# EAGLE board SOM204-EVB_Rev_B (EAGLE 4.16), part 1 of 4
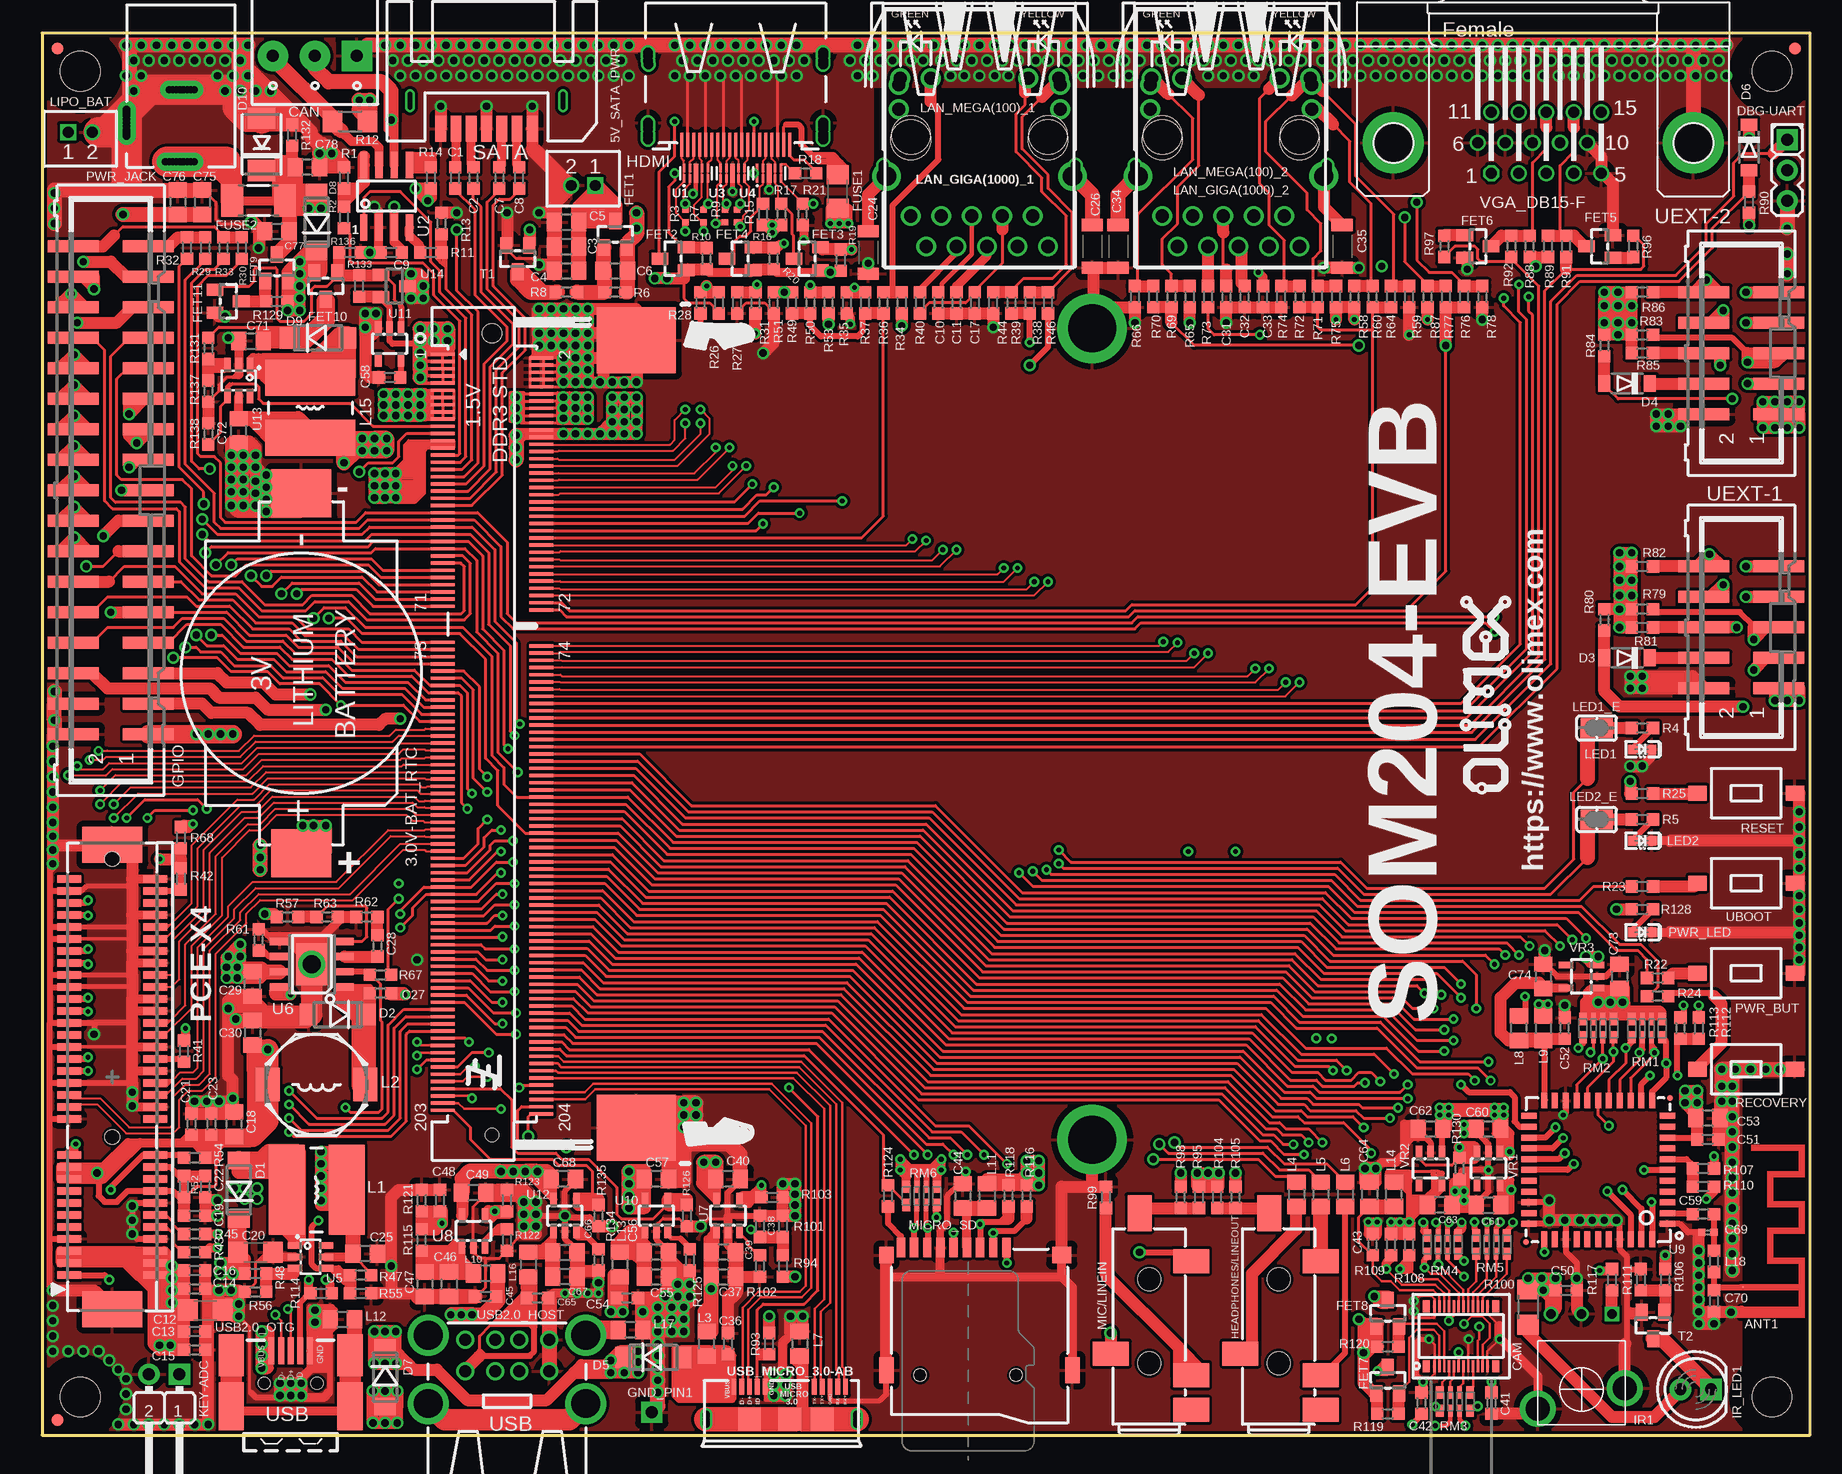
[diagram p5: board, top side]
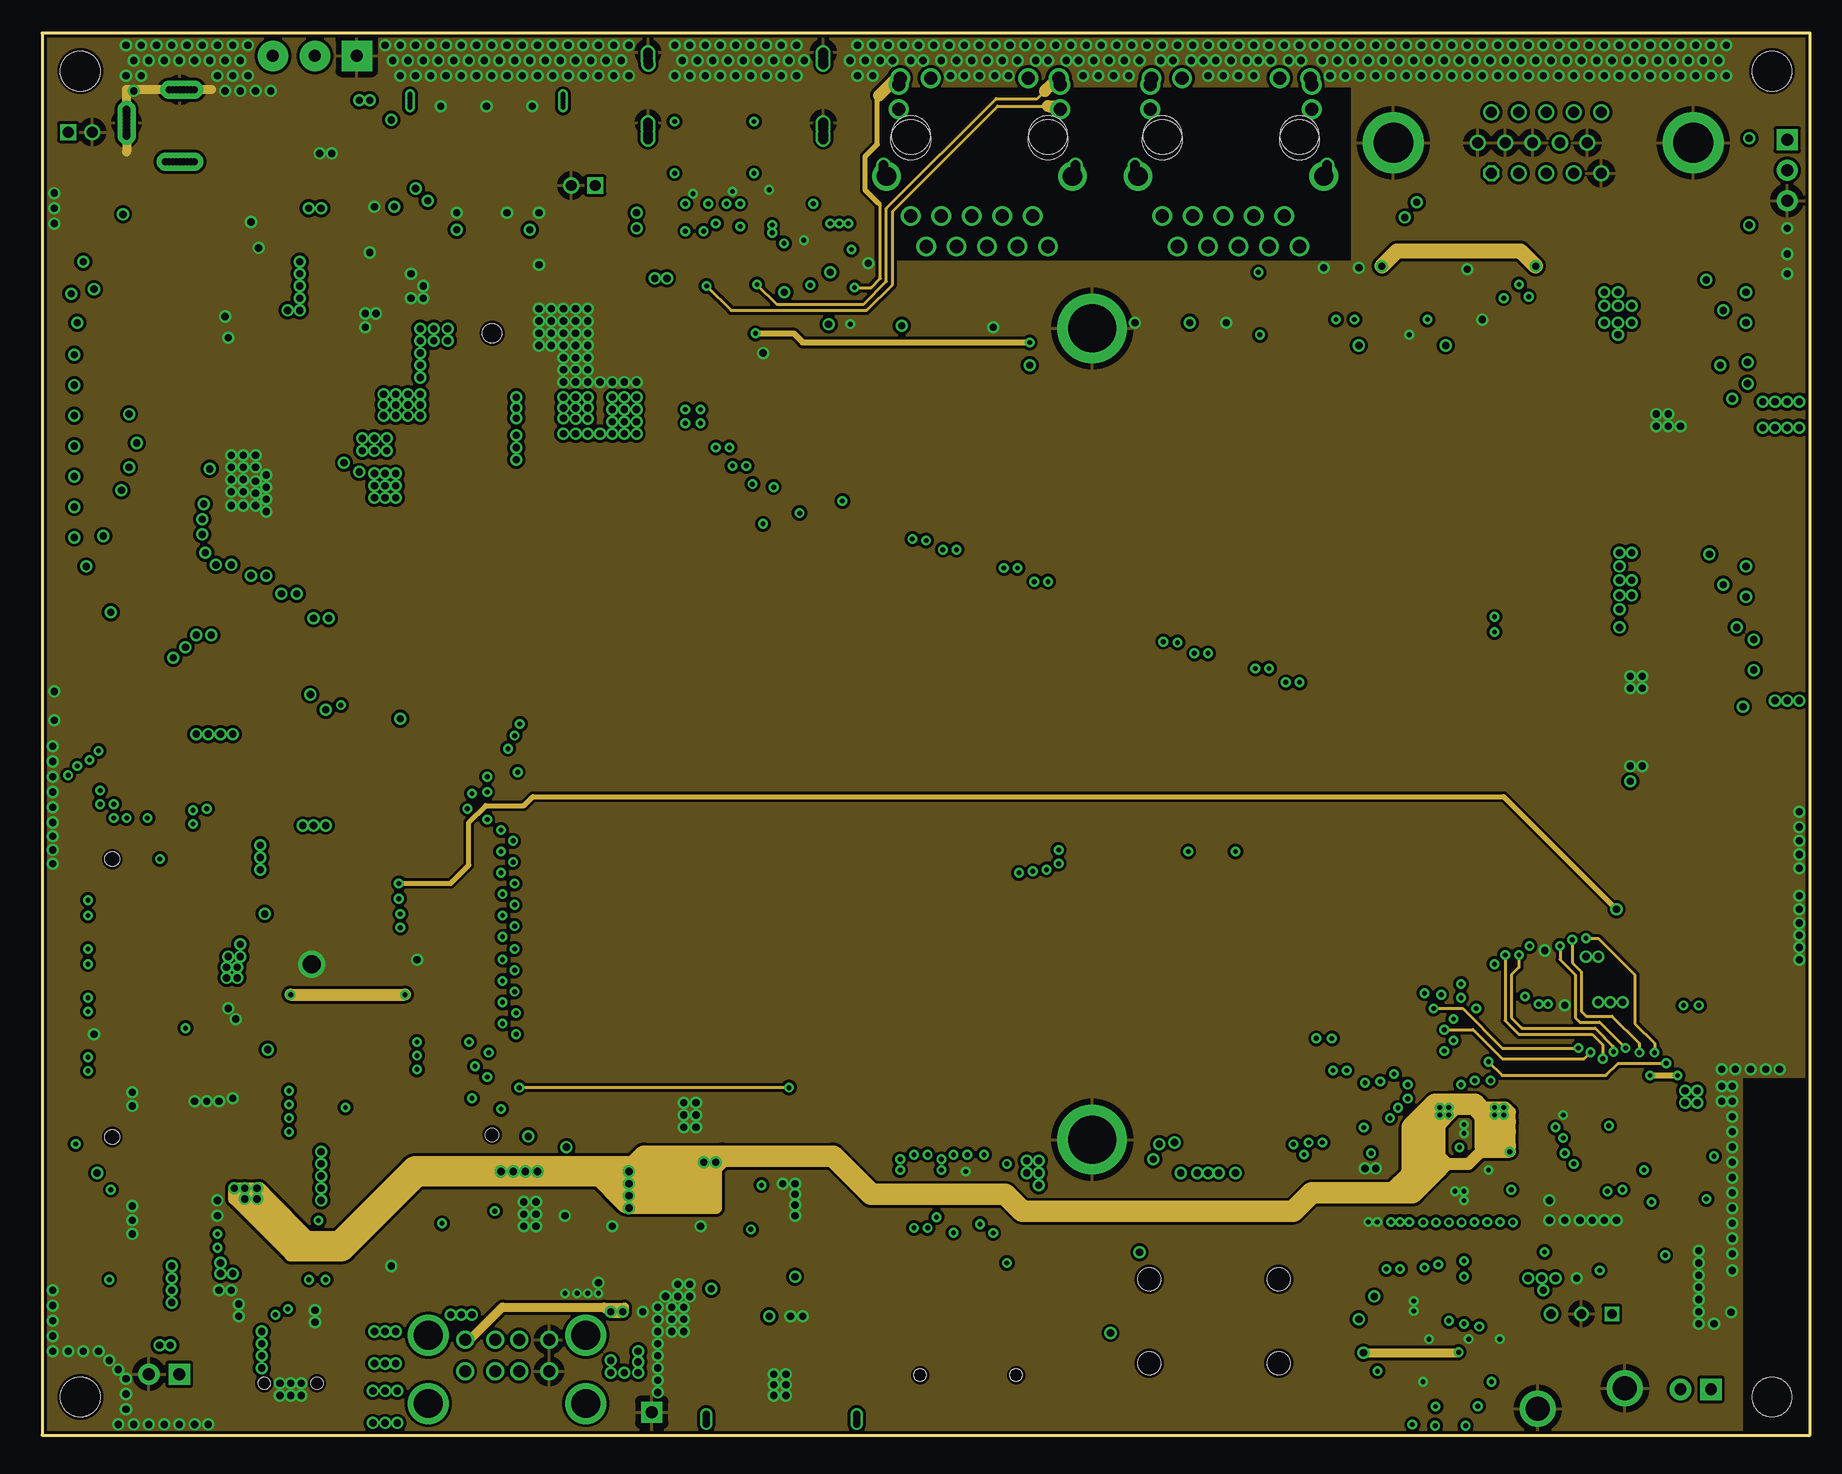
[diagram p6: board, inner layer Route2]
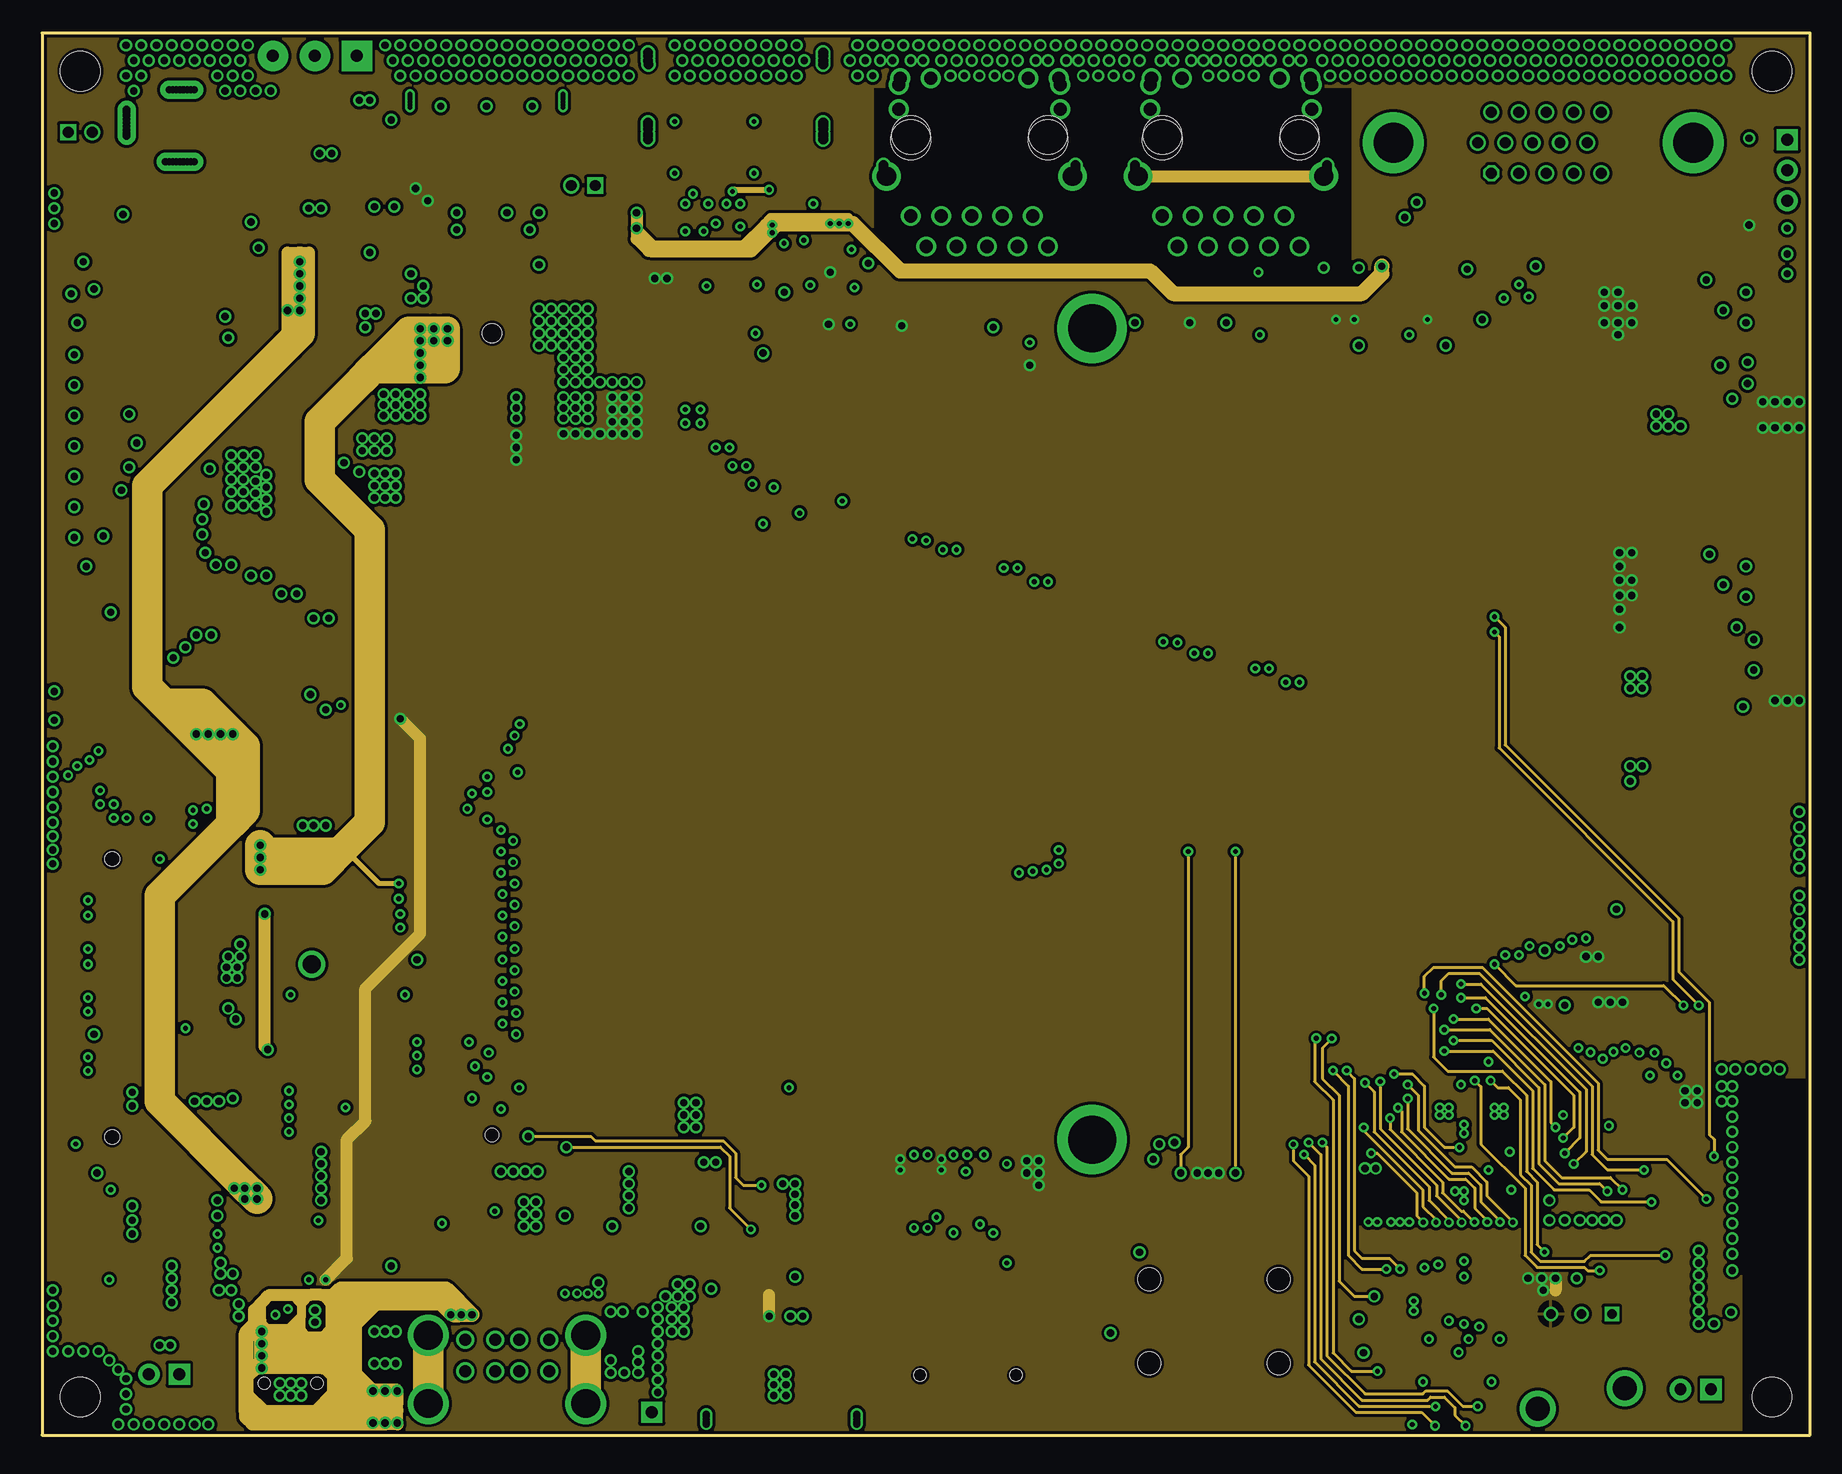
[diagram p7: board, inner layer Route15]
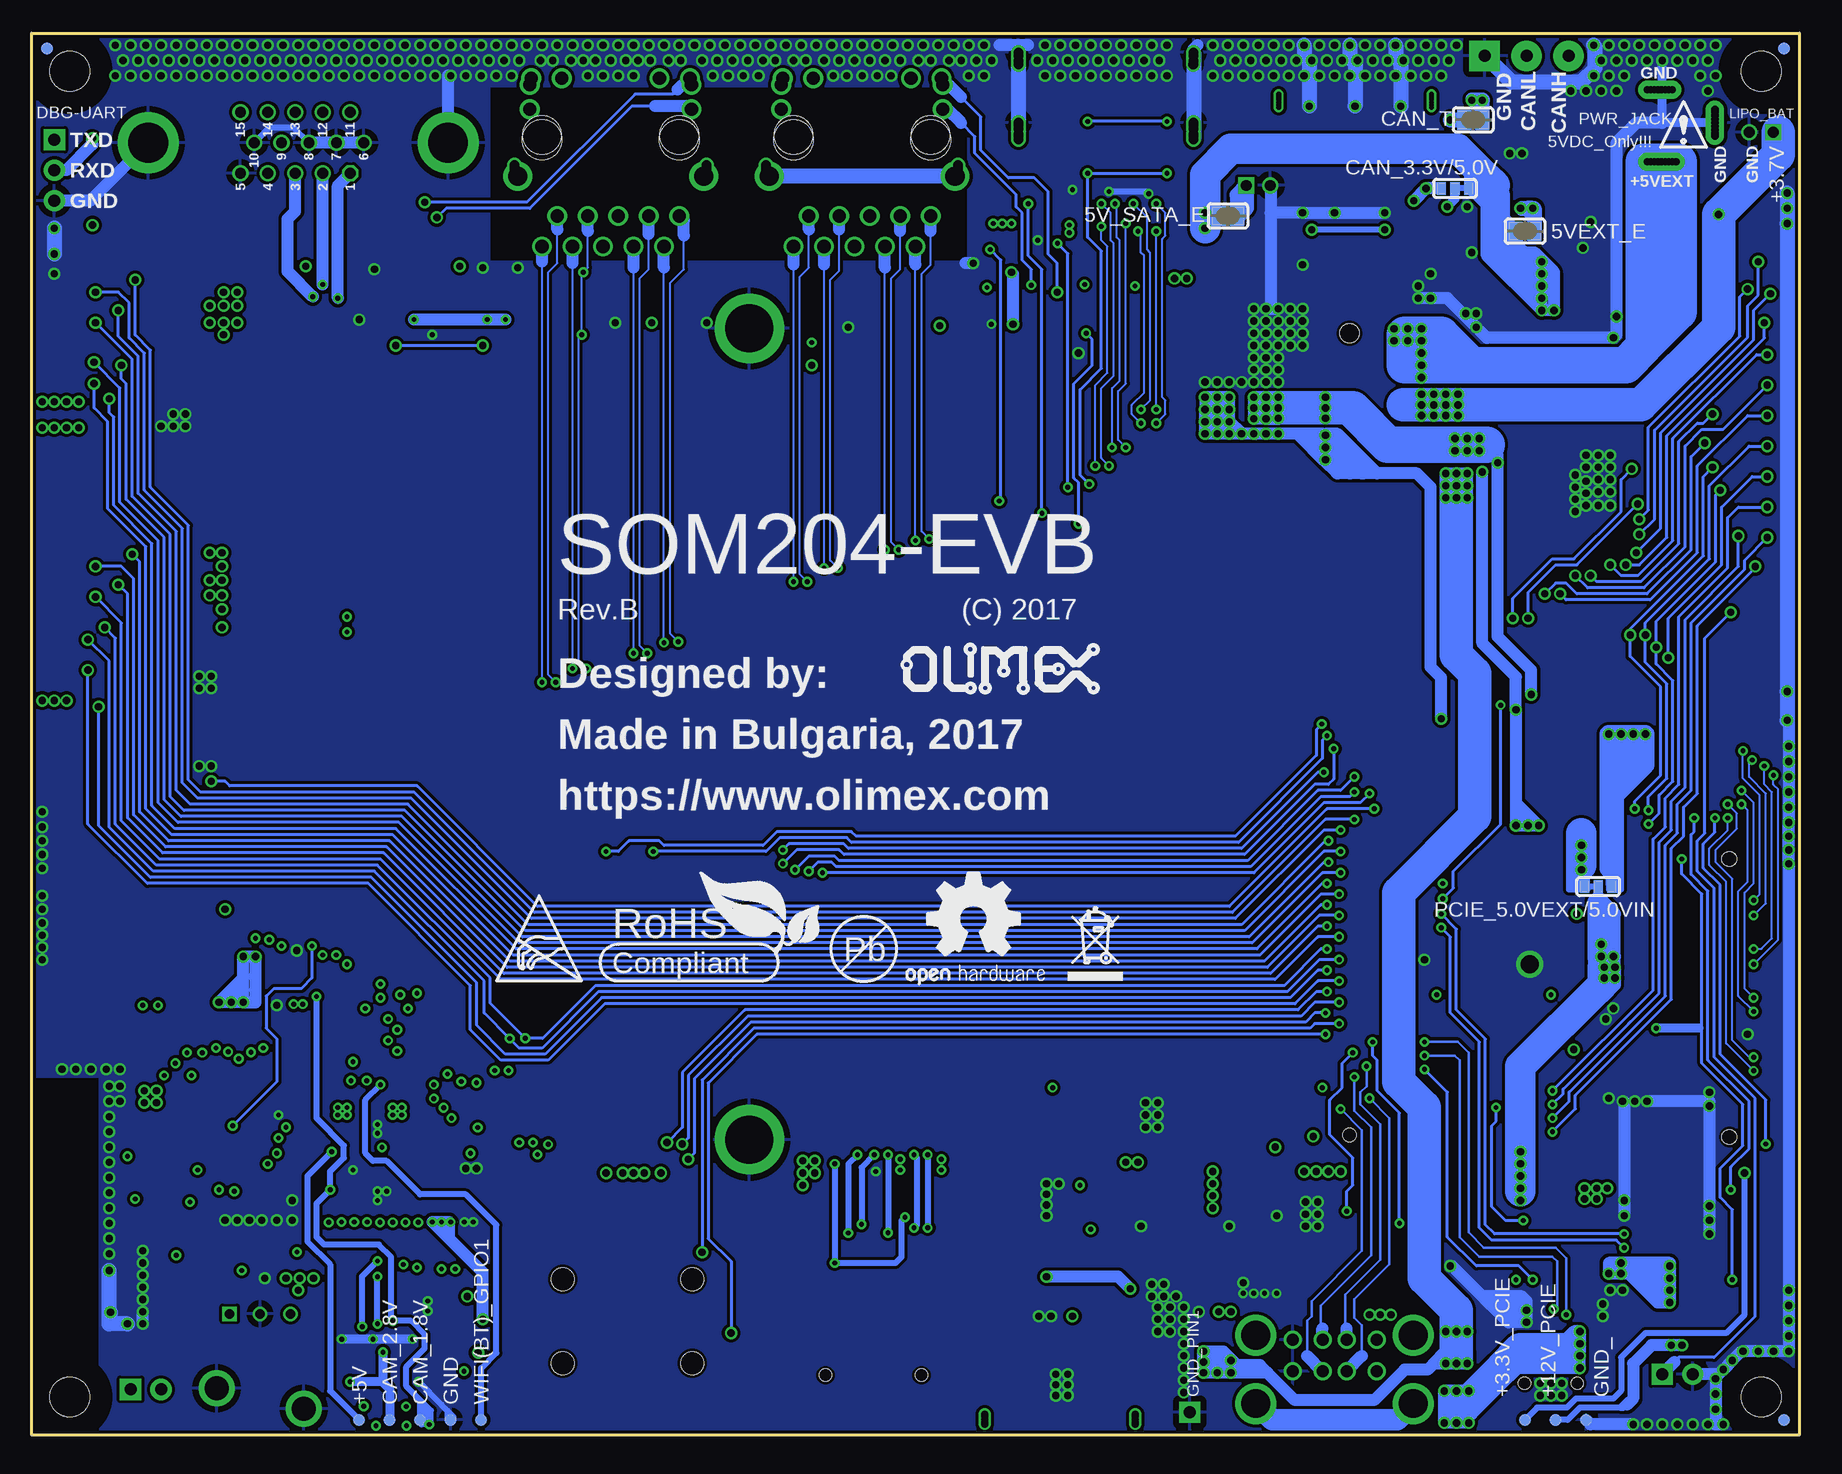
[diagram p8: board, bottom side, seen from below]

Size 147.32 x 116.84 mm. Coordinates in mm from the lower left corner, seen from the top.
Outline: 0,116.84 0,0 147.32,0 147.32,116.84 0,116.84
Copper layers (1*2+15*16): Top 0.035mm / dielectric 0.127mm / Route2 0.017mm / dielectric 1.1mm / Route15 0.017mm / dielectric 0.127mm / Bottom 0.035mm
Design rules "default": minimum track width 7mil, minimum drill 0.4mm, track to track 9.5mil, track to pad 9.5mil, pad to pad 9.5mil, via to via 9.5mil, smd to smd 1mil, copper to edge 0.2489mm, drill to drill 10mil, minimum pad ring 8mil, minimum via ring 8mil, stop-mask expansion 2mil, vias tented up to drill 40mil, thermal gap 20mil
Holes 3.3 mm at 3.17,3.17 144.15,3.17 144.15,113.67 3.17,113.67
tRestrict: area 0,0 to 6.3,6.3; area 141,0 to 147.3,6.3; area 141,110.5 to 147.3,116.8; area 0,110.5 to 6.3,116.8; 11 lines
bRestrict: area 0,0 to 6.3,6.3; area 141,0 to 147.3,6.3; area 141,110.5 to 147.3,116.8; area 0,110.5 to 6.3,116.8

## Footprints (pad centres in the part's own frame; a part is rotated, then mirrored left to right if it is on the bottom)
3V_BAT_HOLDER = smd 2 x 2: 1+ -15,0 | smd 4 x 5: + -15,0; - 15,0
SJ = smd 1.168 x 1.6: 1 -0.762,0; 2 0.762,0
DW02S = drill 0.9 square: 1 -1,0 | drill 0.9 round: 2 1,0
TESTPAD_40-ROUND = smd 1.016 x 1.016: 1 0,0
SMAL_SIZE-2.4GHZ_PCB_ANTENNA_MIRROR = smd 0.125 x 0.125: ANT -2.55,0.25 | drill 0.6 round: GND -0.45,-0.739
C0603_DWS = smd 1.016 x 1.016: 1 -0.889,0; 2 0.889,0
C0805_5MIL_DWS = smd 1.27 x 1.524: 1 -1.016,0; 2 1.016,0
C1206_5MIL_WS = smd 1.651 x 1.778: 1 -1.46,0; 2 1.46,0
C1206_5MILS_WS_ISO = smd 1.016 x 1.778: 1 -1.778,0; 2 1.778,0
C0402_TI = smd 0.61 x 0.584: 1 -0.508,0; 2 0.508,0
CAM_2M_GT2005 = smd 0.2 x 1: 1 -2.2,-2.5; 2 -2.2,2.5; 3 -1.8,-2.5; 4 -1.8,2.5; 5 -1.4,-2.5; 6 -1.4,2.5; 7 -1,-2.5; 8 -1,2.5; 9 -0.6,-2.5; 10 -0.6,2.5; 11 -0.2,-2.5; 12 -0.2,2.5; 13 0.2,-2.5; 14 0.2,2.5; 15 0.6,-2.5; 16 0.6,2.5; 17 1,-2.5; 18 1,2.5; 19 1.4,-2.5; 20 1.4,2.5; 21 1.8,-2.5; 22 1.8,2.5; 23 2.2,-2.5; 24 2.2,2.5 | smd 0.6 x 1: MP1 -2.9,-2.5; MP2 -2.9,2.5; MP3 2.9,-2.5; MP4 2.9,2.5
DG350-3.5_3P = drill 1 pad 2.54 square: 1 -3.5,0 | drill 1 pad 2.54 round: 2 0,0; 3 3.5,0
SJ_2_SMALL_12_TIED = smd 0.762 x 1.016: 1 -1.143,0; 2 0,0; 3 1.143,0
MLL-41 = smd 1.45 x 1.8: A 2.445,0; K -2.445,0
SOD-123 = smd 1 x 1.4: A 1.9,0; C -1.9,0
DO214AA = smd 1.778 x 2.286: A 2.177,0; C -2.177,0
HN1X3 = drill 1 pad 1.778 square: 1 -2.54,0 | drill 1 pad 1.778 round: 2 0,0; 3 2.54,0
SOT23 = smd 1.4 x 1: 1 1.1,-0.95; 2 1.1,0.95; 3 -1.1,0
FIDUCIAL-1X3 = smd 1 x 1: 1 0,0
1206 = smd 1.6 x 1.8: 1 -1.4,0; 2 1.4,0
R5025 = smd 1.8 x 2.7: 1 -2.2,0; 2 2.2,0
TEST_PAD40/70/SQUARE = drill 1.016 pad 1.778 square: P$1 0,0
ML34-MALE(GBH-254-SMT-34)_TEST = smd 1 x 4.25: 1 -20.32,-3.125; 2 -20.32,3.125; 3 -17.78,-3.125; 4 -17.78,3.125; 5 -15.24,-3.125; 6 -15.24,3.125; 7 -12.7,-3.125; 8 -12.7,3.125; 9 -10.16,-3.125; 10 -10.16,3.125; 11 -7.62,-3.125; 12 -7.62,3.125; 13 -5.08,-3.125; 14 -5.08,3.125; 15 -2.54,-3.125; 16 -2.54,3.125; 17 0,-3.125; 18 0,3.125; 19 2.54,-3.125; 20 2.54,3.125; 21 5.08,-3.125; 22 5.08,3.125; 23 7.62,-3.125; 24 7.62,3.125; 25 10.16,-3.125; 26 10.16,3.125; 27 12.7,-3.125; 28 12.7,3.125; 29 15.24,-3.125; 30 15.24,3.125; 31 17.78,-3.125; 32 17.78,3.125; 33 20.32,-3.125; 34 20.32,3.125
HDMI-SWM-19_TEST = smd 0.25 x 2: 1 -4.5,-5.75; 2 -4,-5.75; 3 -3.5,-5.75; 4 -3,-5.75; 5 -2.5,-5.75; 6 -2,-5.75; 7 -1.5,-5.75; 8 -1,-5.75; 9 -0.5,-5.75; 10 0,-5.75; 11 0.5,-5.75; 12 1,-5.75; 13 1.5,-5.75; 14 2,-5.75; 15 2.5,-5.75; 16 3,-5.75; 17 3.5,-5.75; 18 4,-5.75; 19 4.5,-5.75 | drill 0.8 round: P$5 -7.3,-4.85; P$7 -7.3,1.25; P$9 7.3,1.25; P$11 7.3,-4.85; P$13 -7.3,-4.45; P$15 -7.3,1.65; P$18 7.3,1.65; P$20 7.3,-4.45; P$21 -7.3,-4.15; P$22 -7.3,-5; P$23 7.3,-5; P$24 7.3,-4.15; P$25 -7.3,-5.3; P$26 7.3,-5.3; P$27 7.3,0.95; P$28 -7.275,0.95; SH1 -7.3,-3.9; SH2 -7.3,1.95; SH3 7.3,1.95; SH4 7.3,-3.9
PJ-W47S-05D2-LF_5PIN_V2 = smd 2 x 3: 1 2.1,-0.5; 2 14.5,-0.5; 3 6.8,6.2; 5 5,-0.5 | smd 3 x 2: 4 18.5,3.8 | hole 1.9: 6,3; 13,3
RPM7236 = drill 0.8 square: 1 -2.54,-6.3 | drill 0.8 round: 2 0,-6.3; 3 2.54,-6.3 | drill 2 round: P$4 -3.63,-0.1; P$5 3.63,1.6
LED-5.0MM = drill 0.991 pad 1.778 round: A -1.27,0 | drill 0.991 pad 1.778 square: K 1.27,0
JP1R = drill 1 pad 1.778 square: 1 -1.27,0 | drill 1 pad 1.778 round: 2 1.27,0
CD73(75) = smd 3 x 7.5: 1 -2.5,0; 2 2.5,0
CDRH8D43 = smd 2 x 2.8: 1 -4.05,0; 2 4.05,0
L0805_5MIL_DWS = smd 1.27 x 1.524: 1 -1.016,0; 2 1.016,0
L0603_5MIL_DWS = smd 1.016 x 1.016: 1 -0.889,0; 2 0.889,0
TM211Q01FM22_SH = drill 1.1 round: 1 -5.715,-6.35; 2 -4.445,-8.89; 3 -3.175,-6.35; 4 -1.905,-8.89; 5 -0.635,-6.35; 6 0.635,-8.89; 7 1.905,-6.35; 8 3.175,-8.89; 9 4.445,-6.35; 10 5.715,-8.89; 11 -6.731,2.54; 12 -6.731,4.572; 13 6.731,2.54; 14 6.731,4.572 | drill 1.6 round: SH1 -7.747,-3.048; SH2 7.747,-3.048 | hole 3.3: 5.715,0; -5.715,0
RJLBC-060TC1_MILLING = drill 0.9 round: 1 -4.455,6.7; 2 -3.185,9.24; 3 -1.915,6.7; 4 -0.645,9.24; 5 0.625,6.7; 6 1.895,9.24; 7 3.165,6.7; 8 4.435,9.24 | drill 0.8 round: _1 -8,2.5; _2 -8,2.7; _3 -8,2.9; _4 -8,3.3; _5 -8,3.5; _6 8,3.5; _7 8,3.3; _8 8,2.9; _9 8,2.7; _10 8,2.5; GND1 -8,3.1; GND2 8,3.1 | drill 1.1 round: AG 4.07,-4.748; AY -6.61,-4.748; KG 6.61,-4.748; KY -4.07,-4.748 | hole 3.2: -5.715,0; 5.715,0
LED-0603_TEST = smd 0.8 x 0.8: A 0.762,0; C -0.762,0
SJ-CLOSE = smd 1.168 x 1.6: 1 -0.762,0; 2 0.762,0
TFC-WPAPR-08_BIGGER_CREAM = smd 1.6 x 0.7: 1 -6.994,2.25; 2 -6.994,1.15; 3 -6.994,0.05; 4 -6.994,-1.05; 5 -6.994,-2.15; 6 -6.994,-3.25; 7 -6.994,-4.35; 8 -6.994,-5.45; 9 -6.994,-6.55 | smd 1.4 x 1.2: 10 -6.369,-7.75 | smd 1.4 x 1.6: 11 -6.369,6.85 | smd 2.2 x 1.2: 12 3.231,-7.75; 13 3.231,7.75 | hole 1: 3.631,-4.95; 3.631,3.05
PCIX-VPC-064-LF = smd 0.6 x 2: 1 16.5,-3.6; 2 16.5,3.6; 3 15.5,-3.6; 4 15.5,3.6; 5 14.5,-3.6; 6 14.5,3.6; 7 13.5,-3.6; 8 13.5,3.6; 9 12.5,-3.6; 10 12.5,3.6; 11 11.5,-3.6; 12 11.5,3.6; 13 10.5,-3.6; 14 10.5,3.6; 15 9.5,-3.6; 16 9.5,3.6; 17 8.5,-3.6; 18 8.5,3.6; 19 7.5,-3.6; 20 7.5,3.6; 21 6.5,-3.6; 22 6.5,3.6; 23 3.5,-3.6; 24 3.5,3.6; 25 2.5,-3.6; 26 2.5,3.6; 27 1.5,-3.6; 28 1.5,3.6; 29 0.5,-3.6; 30 0.5,3.6; 31 -0.5,-3.6; 32 -0.5,3.6; 33 -1.5,-3.6; 34 -1.5,3.6; 35 -2.5,-3.6; 36 -2.5,3.6; 37 -3.5,-3.6; 38 -3.5,3.6; 39 -4.5,-3.6; 40 -4.5,3.6; 41 -5.5,-3.6; 42 -5.5,3.6; 43 -6.5,-3.6; 44 -6.5,3.6; 45 -7.5,-3.6; 46 -7.5,3.6; 47 -8.5,-3.6; 48 -8.5,3.6; 49 -9.5,-3.6; 50 -9.5,3.6; 51 -10.5,-3.6; 52 -10.5,3.6; 53 -11.5,-3.6; 54 -11.5,3.6; 55 -12.5,-3.6; 56 -12.5,3.6; 57 -13.5,-3.6; 58 -13.5,3.6; 59 -14.5,-3.6; 60 -14.5,3.6; 61 -15.5,-3.6; 62 -15.5,3.6; 63 -16.5,-3.6; 64 -16.5,3.6 | smd 3 x 5: MP1 19.35,0; MP2 -19.35,0 | hole 1.2: 5,0; -18.15,0
WS-TAKT_6X3.5_SMD_NOCREAM = smd 1.27 x 1.524: P$1 0,4.064; P$2 0,-4.064
PWR_JACK_UNI_MILLING_SMALLER_DRILLS = drill 0.6 pad 1.5 round: + -0.196,4.75; +1 -0.196,5.05; +2 -0.196,5.35; +3 -0.196,5.65; +4 -0.196,4.45; +5 -0.196,4.15; +6 -0.196,3.85; +7 -0.196,3.55; +8 -0.196,5.95; - -6.196,4.75; -1 -6.196,5.05; -2 -6.196,5.35; -3 -6.196,4.45; -4 -6.196,4.15; -5 -6.196,5.65; -6 -6.196,3.85; -8 -6.196,5.95; -- -3.446,0.3; --1 -3.746,0.3; --2 -4.046,0.3; --3 -4.346,0.3; --4 -3.146,0.3; --5 -2.846,0.3; --6 -2.546,0.3; --14 -4.546,0.3; --15 -2.346,0.3
R0603_5MIL_DWS = smd 1.016 x 1.016: 1 -0.889,0; 2 0.889,0
R0402_SMALL = smd 0.5 x 0.55: 1 -0.508,0; 2 0.508,0
R1206_5MIL_WS = smd 1.651 x 1.778: 1 -1.46,0; 2 1.46,0
0603_0R = smd 1.016 x 1.016: 1 -0.889,0; 2 0.889,0
R1206_5MIL = smd 1.651 x 1.778: 1 -1.46,0; 2 1.46,0
R_MATRIX_4 = smd 0.635 x 1.016: 1.1 -1.27,-0.762; 1.2 -1.27,0.762; 4.1 1.27,-0.762; 4.2 1.27,0.762 | smd 0.381 x 1.016: 2.1 -0.381,-0.762; 2.2 -0.381,0.762; 3.1 0.381,-0.762; 3.2 0.381,0.762
SATA-PWA-07-TEST = smd 0.9 x 2.2: 1 -4.25,-4.8; 2 -2.98,-4.8; 3 -1.71,-4.8; 4 -0.44,-4.8; 5 0.83,-4.8; 6 2.1,-4.8; 7 3.37,-4.8 | drill 0.4 round: P$1 -6.81,-2.35; P$2 -6.81,-2.125; P$3 -6.81,-2.6; P$4 -6.81,-1.925; P$5 -6.81,-3.025; P$11 5.93,-2.35; P$20 5.93,-2.125; P$23 5.93,-2.6; P$24 5.93,-1.925; P$26 5.93,-3.025; SH1 -6.81,-2.825; SH4 5.93,-2.825
DDR204(2-2013289-1) = smd 0.27 x 2: 1 -31.65,-4.1; 2 -31.35,4.1; 3 -31.05,-4.1; 4 -30.75,4.1; 5 -30.45,-4.1; 6 -30.15,4.1; 7 -29.85,-4.1; 8 -29.55,4.1; 9 -29.25,-4.1; 10 -28.95,4.1; 11 -28.65,-4.1; 12 -28.35,4.1; 13 -28.05,-4.1; 14 -27.75,4.1; 15 -27.45,-4.1; 16 -27.15,4.1; 17 -26.85,-4.1; 18 -26.55,4.1; 19 -26.25,-4.1; 20 -25.95,4.1; 21 -25.65,-4.1; 22 -25.35,4.1; 23 -25.05,-4.1; 24 -24.75,4.1; 25 -24.45,-4.1; 26 -24.15,4.1; 27 -23.85,-4.1; 28 -23.55,4.1; 29 -23.25,-4.1; 30 -22.95,4.1; 31 -22.65,-4.1; 32 -22.35,4.1; 33 -22.05,-4.1; 34 -21.75,4.1; 35 -21.45,-4.1; 36 -21.15,4.1; 37 -20.85,-4.1; 38 -20.55,4.1; 39 -20.25,-4.1; 40 -19.95,4.1; 41 -19.65,-4.1; 42 -19.35,4.1; 43 -19.05,-4.1; 44 -18.75,4.1; 45 -18.45,-4.1; 46 -18.15,4.1; 47 -17.85,-4.1; 48 -17.55,4.1; 49 -17.25,-4.1; 50 -16.95,4.1; 51 -16.65,-4.1; 52 -16.35,4.1; 53 -16.05,-4.1; 54 -15.75,4.1; 55 -15.45,-4.1; 56 -15.15,4.1; 57 -14.85,-4.1; 58 -14.55,4.1; 59 -14.25,-4.1; 60 -13.95,4.1; 61 -13.65,-4.1; 62 -13.35,4.1; 63 -13.05,-4.1; 64 -12.75,4.1; 65 -12.45,-4.1; 66 -12.15,4.1; 67 -11.85,-4.1; 68 -11.55,4.1; 69 -11.25,-4.1; 70 -10.95,4.1; 71 -10.65,-4.1; 72 -10.35,4.1; 73 -7.65,-4.1; 74 -7.35,4.1; 75 -7.05,-4.1; 76 -6.75,4.1; 77 -6.45,-4.1; 78 -6.15,4.1; 79 -5.85,-4.1; 80 -5.55,4.1; 81 -5.25,-4.1; 82 -4.95,4.1; 83 -4.65,-4.1; 84 -4.35,4.1; 85 -4.05,-4.1; 86 -3.75,4.1; 87 -3.45,-4.1; 88 -3.15,4.1; 89 -2.85,-4.1; 90 -2.55,4.1; 91 -2.25,-4.1; 92 -1.95,4.1; 93 -1.65,-4.1; 94 -1.35,4.1; 95 -1.05,-4.1; 96 -0.75,4.1; 97 -0.45,-4.1; 98 -0.15,4.1; 99 0.15,-4.1; 100 0.45,4.1; 101 0.75,-4.1; 102 1.05,4.1; 103 1.35,-4.1; 104 1.65,4.1; 105 1.95,-4.1; 106 2.25,4.1; 107 2.55,-4.1; 108 2.85,4.1; 109 3.15,-4.1; 110 3.45,4.1; 111 3.75,-4.1; 112 4.05,4.1; 113 4.35,-4.1; 114 4.65,4.1; 115 4.95,-4.1; 116 5.25,4.1; 117 5.55,-4.1; 118 5.85,4.1; 119 6.15,-4.1; 120 6.45,4.1; 121 6.75,-4.1; 122 7.05,4.1; 123 7.35,-4.1; 124 7.65,4.1; 125 7.95,-4.1; 126 8.25,4.1; 127 8.55,-4.1; 128 8.85,4.1; 129 9.15,-4.1; 130 9.45,4.1; 131 9.75,-4.1; 132 10.05,4.1; 133 10.35,-4.1; 134 10.65,4.1; 135 10.95,-4.1; 136 11.25,4.1; 137 11.55,-4.1; 138 11.85,4.1; 139 12.15,-4.1; 140 12.45,4.1; 141 12.75,-4.1; 142 13.05,4.1; 143 13.35,-4.1; 144 13.65,4.1; 145 13.95,-4.1; 146 14.25,4.1; 147 14.55,-4.1; 148 14.85,4.1; 149 15.15,-4.1; 150 15.45,4.1; 151 15.75,-4.1; 152 16.05,4.1; 153 16.35,-4.1; 154 16.65,4.1; 155 16.95,-4.1; 156 17.25,4.1; 157 17.55,-4.1; 158 17.85,4.1; 159 18.15,-4.1; 160 18.45,4.1; 161 18.75,-4.1; 162 19.05,4.1; 163 19.35,-4.1; 164 19.65,4.1; 165 19.95,-4.1; 166 20.25,4.1; 167 20.55,-4.1; 168 20.85,4.1; 169 21.15,-4.1; 170 21.45,4.1; 171 21.75,-4.1; 172 22.05,4.1; 173 22.35,-4.1; 174 22.65,4.1; 175 22.95,-4.1; 176 23.25,4.1; 177 23.55,-4.1; 178 23.85,4.1; 179 24.15,-4.1; 180 24.45,4.1; 181 24.75,-4.1; 182 25.05,4.1; 183 25.35,-4.1; 184 25.65,4.1; 185 25.95,-4.1; 186 26.25,4.1; 187 26.55,-4.1; 188 26.85,4.1; 189 27.15,-4.1; 190 27.45,4.1; 191 27.75,-4.1; 192 28.05,4.1; 193 28.35,-4.1; 194 28.65,4.1; 195 28.95,-4.1; 196 29.25,4.1; 197 29.55,-4.1; 198 29.85,4.1; 199 30.15,-4.1; 200 30.45,4.1; 201 30.75,-4.1; 202 31.05,4.1; 203 31.35,-4.1; 204 31.65,4.1 | drill 4 pad 5.8 round: MH1 -33.8,50; MH2 33.8,50 | smd 5.5 x 6.6: MP1 -32.8,12; MP2 32.8,12 | hole 1.6: -33.4,0 | hole 1.1: 33.4,0
SOT-23 = smd 1.4 x 1: 1 1.1,-0.95; 2 1.1,0.95; 3 -1.1,0
SLP2510P8 = smd 0.2 x 0.675: 1 -1,-0.438; 2 -0.5,-0.438; 4 0.5,-0.438; 5 1,-0.438; 6 1,0.438; 7 0.5,0.438; 9 -0.5,0.438; 10 -1,0.438 | smd 0.4 x 0.775: 3 0,-0.388; 8 0,0.388
SO-08 = smd 0.6 x 2.2: 1 -1.905,-2.6; 2 -0.635,-2.6; 3 0.635,-2.6; 4 1.905,-2.6; 5 1.905,2.6; 6 0.635,2.6; 7 -0.635,2.6; 8 -1.905,2.6
SOT23-6 = smd 1.2 x 0.55: 1 1.3,-0.95; 2 1.3,0; 3 1.3,0.95; 4 -1.3,0.95; 5 -1.3,0; 6 -1.3,-0.95
SOIC8E = smd 0.61 x 1.6: 1 -1.905,-2.7; 2 -0.635,-2.7; 3 0.635,-2.7; 4 1.905,-2.7; 5 1.905,2.7; 6 0.635,2.7; 7 -0.635,2.7; 8 -1.905,2.7 | smd 3.51 x 2.62: EP 0,0 | drill 1.5 round: EP1 0,0
SOT23-5 = smd 1.2 x 0.55: 1 1.3,-0.95; 2 1.3,0; 3 1.3,0.95; 4 -1.3,0.95; 5 -1.3,-0.95
RL-SM02BD(RTL8723BS) = smd 1.3 x 0.5: 1 -5.775,4.5; 2 -5.775,3.6; 3 -5.775,2.7; 4 -5.775,1.8; 5 -5.775,0.9; 6 -5.775,0; 7 -5.775,-0.9; 8 -5.775,-1.8; 9 -5.775,-2.7; 10 -5.775,-3.6; 11 -5.775,-4.5; 23 5.775,-4.5; 24 5.775,-3.6; 25 5.775,-2.7; 26 5.775,-1.8; 27 5.775,-0.9; 28 5.775,0; 29 5.775,0.9; 30 5.775,1.8; 31 5.775,2.7; 32 5.775,3.6; 33 5.775,4.5 | smd 0.5 x 1.3: 12 -4.5,-5.775; 13 -3.6,-5.775; 14 -2.7,-5.775; 15 -1.8,-5.775; 16 -0.9,-5.775; 17 0,-5.775; 18 0.9,-5.775; 19 1.8,-5.775; 20 2.7,-5.775; 21 3.6,-5.775; 22 4.5,-5.775; 34 4.5,5.775; 35 3.6,5.775; 36 2.7,5.775; 37 1.8,5.775; 38 0.9,5.775; 39 0,5.775; 40 -0.9,5.775; 41 -1.8,5.775; 42 -2.7,5.775; 43 -3.6,5.775; 44 -4.5,5.775 | smd 0.5 x 0.5: FID1 -6,-6; FID2 6,6
ML10-MALE(GBH-254-SMT-10)_TEST = smd 1 x 4.25: 1 -5.08,-3.125; 2 -5.08,3.125; 3 -2.54,-3.125; 4 -2.54,3.125; 5 0,-3.125; 6 0,3.125; 7 2.54,-3.125; 8 2.54,3.125; 9 5.08,-3.125; 10 5.08,3.125
USB_TWO_LEVEL = drill 1 round: 1.1 -3.5,2.62; 1.2 -1,2.62; 1.3 1,2.62; 1.4 3.5,2.62; 2.1 -3.5,0; 2.2 -1,0; 2.3 1,0; 2.4 3.5,0 | drill 2.4 round: GND1 -6.57,-2.7; GND2 6.57,-2.7; GND3 6.57,3; GND4 -6.57,3
USB_MINI_9PIN = smd 2.25 x 0.5: D+ -3.722,0; D- -3.722,-0.8; GND -3.722,1.6; ID -3.722,0.8; VBUS -3.722,-1.6 | smd 4 x 2.1: GND1 0.884,-4.95; GND3 0.884,4.95 | smd 3.5 x 2.1: GND2 -3.366,-4.95; GND4 -3.366,4.95 | hole 1: -1.016,-2.2; -1.016,2.2
USB_MICRO_3.0 = smd 0.4 x 1.35: 1 -3.95,2; 2 -3.3,2; 3 -2.65,2; 4 -2,2; 5 -1.35,2; 6 2.75,2; 7 3.4,2; 8 4.05,2; 9 4.7,2; 10 5.35,2 | drill 0.6 round: P$1 -6.26,-0.45; P$2 -6.26,-0.95; P$3 6.29,-0.45; P$4 6.29,-0.95; P$5 -6.26,-0.3; P$6 -6.26,-1.1; P$7 6.29,-0.3; P$8 6.29,-1.1; SH1 -6.26,-0.7; SH2 6.29,-0.7 | smd 1.9 x 1.9: SH3 -2.65,-0.7; SH6 3.4,-0.7 | smd 0.95 x 1.9: SH4 0.225,-0.7; SH5 1.175,-0.7
DB15-F_22MM = drill 0.9 octagon: 1 4.329,6.35 | drill 0.9 round: 2 2.043,6.35; 3 -0.243,6.35; 4 -2.529,6.35; 5 -4.815,6.35; 6 5.472,3.81; 7 3.186,3.81; 8 0.9,3.81; 9 -1.386,3.81; 10 -3.672,3.81; 11 4.329,1.27; 12 2.043,1.27; 13 -0.243,1.27; 14 -2.529,1.27; 15 -4.815,1.27 | drill 3.302 pad 5.08 round: GND1 -12.497,3.81; GND2 12.497,3.81
SOT-23-5 = smd 1.2 x 0.55: 1 1.3,-0.95; 2 1.3,0; 3 1.3,0.95; 4 -1.3,0.95; 5 -1.3,-0.95

## Placement (x,y rotation side)
3.0V-BAT_RTC  BTH-V-20-LF  [3V_BAT_HOLDER]  21.59,63.5 90 top
5V_SATA_E  Opened  [SJ]  47.62,101.6 180 bottom
5V_SATA_PWR  DW02S  [DW02S]  45.09,104.14 180 top
5VEXT_E  Opened  [SJ]  22.86,100.33 180 bottom
+3.3V_PCIE  TESTPADTESTPAD_40-ROUND  [TESTPAD_40-ROUND]  22.86,1.27 270 bottom
+5V  TESTPADTESTPAD_40-ROUND  [TESTPAD_40-ROUND]  120.02,1.27 180 bottom
+12V_PCIE  TESTPADTESTPAD_40-ROUND  [TESTPAD_40-ROUND]  20.32,1.27 270 bottom
ANT1  PCB-ANTENNA  [SMAL_SIZE-2.4GHZ_PCB_ANTENNA_MIRROR]  141.48,9.78 270 top
C1  10nF/50V/10%/X7R/C0603  [C0603_DWS]  34.42,104.78 90 top
C2  10nF/50V/10%/X7R/C0603  [C0603_DWS]  35.94,104.78 90 top
C3  47uF/6.3V/20%/X5R/C0805  [C0805_5MIL_DWS]  43.69,99.06 0 top
C4  47uF/6.3V/20%/X5R/C0805  [C0805_5MIL_DWS]  43.69,97.03 0 top
C5  47uF/6.3V/20%/X5R/C0805  [C0805_5MIL_DWS]  43.69,101.09 0 top
C6  47uF/6.3V/20%/X5R/C0805  [C0805_5MIL_DWS]  47.75,97.03 0 top
C7  10nF/50V/10%/X7R/C0603  [C0603_DWS]  38.1,104.78 90 top
C8  10nF/50V/10%/X7R/C0603  [C0603_DWS]  39.75,104.78 90 top
C9  100nF/50V/20%/Y5V/C0603  [C0603_DWS]  29.08,98.55 180 top
C10  NA(100nF/50V/20%/Y5V/C0603)  [C0603_DWS]  74.68,94.36 90 top
C11  NA(100nF/50V/20%/Y5V/C0603)  [C0603_DWS]  76.2,94.36 90 top
C12  22uF/25V/X7R/C1206  [C1206_5MIL_WS]  13.59,10.41 0 top
C13  100nF/50V/20%/Y5V/C0603  [C0603_DWS]  12.7,8.64 0 top
C14  100nF/50V/20%/Y5V/C0603  [C0603_DWS]  12.7,12.19 0 top
C15  100nF/50V/20%/Y5V/C0603  [C0603_DWS]  12.7,7.11 0 top
C16  100nF/50V/20%/Y5V/C0603  [C0603_DWS]  12.7,13.72 0 top
C17  100nF/50V/20%/Y5V/C0603  [C0603_DWS]  77.72,94.36 90 top
C18  47uF/6.3V/20%/X5R/C0805  [C0805_5MIL_DWS]  16,25.91 90 top
C19  100nF/50V/20%/Y5V/C0603  [C0603_DWS]  12.7,18.29 0 top
C20  22uF/25V/X7R/C1206  [C1206_5MIL_WS]  17.78,15.24 0 top
C21  100nF/50V/20%/Y5V/C0603  [C0603_DWS]  12.45,25.91 90 top
C22  100nF/50V/20%/Y5V/C0603  [C0603_DWS]  13.59,20.7 270 top
C23  100nF/50V/20%/Y5V/C0603  [C0603_DWS]  14.1,25.91 90 top
C24  1nF/2kV/X7R/C1206  [C1206_5MILS_WS_ISO]  68.83,98.55 270 top
C25  47uF/6.3V/20%/X5R/C0805  [C0805_5MIL_DWS]  26.92,15.11 180 top
C26  NA(1nF/2kV/X7R/C1206)  [C1206_5MILS_WS_ISO]  87.5,99.06 270 top
C27  100nF/50V/20%/Y5V/C0603  [C0603_DWS]  28.19,36.83 180 top
C28  220pF/50V/5%/COG/C0603  [C0603_DWS]  27.94,40.77 90 top
C29  47uF/6.3V/20%/X5R/C0805  [C0805_5MIL_DWS]  17.53,37.59 90 top
C30  47uF/6.3V/20%/X5R/C0805  [C0805_5MIL_DWS]  17.53,33.53 270 top
C31  100nF/50V/20%/Y5V/C0603  [C0603_DWS]  98.68,94.87 90 top
C32  100nF/50V/20%/Y5V/C0603  [C0603_DWS]  100.2,94.87 90 top
C33  NA(100nF/50V/20%/Y5V/C0603)  [C0603_DWS]  101.73,94.87 90 top
C34  NA(1nF/2kV/X7R/C1206)  [C1206_5MILS_WS_ISO]  89.66,99.06 270 top
C35  1nF/2kV/X7R/C1206  [C1206_5MILS_WS_ISO]  108.33,99.06 270 top
C36  100nF/50V/20%/Y5V/C0603  [C0603_DWS]  57.15,7.62 90 top
C37  47uF/6.3V/20%/X5R/C0805  [C0805_5MIL_DWS]  56.77,13.21 0 top
C38  100nF/50V/20%/Y5V/C0603  [C0603_DWS]  59.82,17.4 90 top
C39  47uF/6.3V/20%/X5R/C0805  [C0805_5MIL_DWS]  56.77,15.24 180 top
C40  47uF/6.3V/20%/X5R/C0805  [C0805_5MIL_DWS]  57.15,21.34 180 top
C41  100nF/50V/20%/Y5V/C0603  [C0603_DWS]  120.78,2.67 270 top
C42  100nF/50V/20%/Y5V/C0603  [C0603_DWS]  114.94,2.67 90 top
C43  100nF/50V/20%/Y5V/C0603  [C0603_DWS]  110.87,15.88 90 top
C44  47uF/6.3V/20%/X5R/C0805  [C0805_5MIL_DWS]  76.71,19.94 270 top
C45  100nF/50V/20%/Y5V/C0603  [C0603_DWS]  36.96,11.56 180 top
C46  47uF/6.3V/20%/X5R/C0805  [C0805_5MIL_DWS]  33.91,12.57 270 top
C47  47uF/6.3V/20%/X5R/C0805  [C0805_5MIL_DWS]  31.88,12.57 270 top
C48  100nF/50V/20%/Y5V/C0603  [C0603_DWS]  33.15,19.56 90 top
C49  47uF/6.3V/20%/X5R/C0805  [C0805_5MIL_DWS]  35.94,20.19 180 top
C50  100nF/50V/20%/Y5V/C0603  [C0603_DWS]  127,12.06 0 top
C51  100nF/50V/20%/Y5V/C0603  [C0603_DWS]  138.81,24.64 0 top
C52  100nF/50V/20%/Y5V/C0603  [C0603_DWS]  126.87,33.91 90 top
C53  47uF/6.3V/20%/X5R/C0805  [C0805_5MIL_DWS]  138.81,26.42 180 top
C54  100nF/50V/20%/Y5V/C0603  [C0603_DWS]  48.77,11.43 0 top
C55  47uF/6.3V/20%/X5R/C0805  [C0805_5MIL_DWS]  51.18,13.21 0 top
C56  47uF/6.3V/20%/X5R/C0805  [C0805_5MIL_DWS]  51.18,15.24 180 top
C57  47uF/6.3V/20%/X5R/C0805  [C0805_5MIL_DWS]  51.18,21.34 180 top
C58  NA(100nF/50V/20%/Y5V/C0603)  [C0603_DWS]  28.96,88.14 180 top
C59  10pF/50V/5%/COG/C0603  [C0603_DWS]  138.43,18.41 0 top
C60  47uF/6.3V/20%/X5R/C0805  [C0805_5MIL_DWS]  120.52,25.53 0 top
C61  47uF/6.3V/20%/X5R/C0805  [C0805_5MIL_DWS]  120.52,19.18 0 top
C62  47uF/6.3V/20%/X5R/C0805  [C0805_5MIL_DWS]  115.7,25.53 0 top
C63  47uF/6.3V/20%/X5R/C0805  [C0805_5MIL_DWS]  116.46,19.18 180 top
C64  47uF/6.3V/20%/X5R/C0805  [C0805_5MIL_DWS]  110.62,20.07 270 top
C65  100nF/50V/20%/Y5V/C0603  [C0603_DWS]  41.27,11.43 0 top
C66  47uF/6.3V/20%/X5R/C0805  [C0805_5MIL_DWS]  43.56,15.24 0 top
C67  47uF/6.3V/20%/X5R/C0805  [C0805_5MIL_DWS]  43.56,13.21 180 top
C68  47uF/6.3V/20%/X5R/C0805  [C0805_5MIL_DWS]  43.43,21.34 180 top
C69  0.8pF/C0402  [C0402_TI]  138.81,16.89 0 top
C70  1.5pF/50V/NP0/C0603  [C0603_DWS]  139.32,11.18 90 top
C71  47uF/6.3V/20%/X5R/C0805  [C0805_5MIL_DWS]  17.4,91.19 0 top
C72  47uF/6.3V/20%/X5R/C0805  [C0805_5MIL_DWS]  16.38,83.69 90 top
C73  NA(47uF/6.3V/20%/X5R/C0805)  [C0805_5MIL_DWS]  131.44,38.23 270 top
C74  NA(47uF/6.3V/20%/X5R/C0805)  [C0805_5MIL_DWS]  125.09,38.23 270 top
C75  47uF/6.3V/20%/X5R/C0805  [C0805_5MIL_DWS]  13.34,102.74 270 top
C76  47uF/6.3V/20%/X5R/C0805  [C0805_5MIL_DWS]  11.3,102.74 270 top
C77  47uF/6.3V/20%/X5R/C0805  [C0805_5MIL_DWS]  19.56,100.33 0 top
C78  47uF/6.3V/20%/X5R/C0805  [C0805_5MIL_DWS]  22.1,105.66 180 top
CAM  CAMERA_2M-GT2005  [CAM_2M_GT2005]  118.24,8.26 0 top
CAM_1.8V  TESTPADTESTPAD_40-ROUND  [TESTPAD_40-ROUND]  114.94,1.27 180 bottom
CAM_2.8V  TESTPADTESTPAD_40-ROUND  [TESTPAD_40-ROUND]  117.47,1.27 180 bottom
CAN  TB3-3.5MM(DG350-3.5_3P)  [DG350-3.5_3P]  22.73,114.94 180 top
CAN_3.3V/5.0V  3.3V:Opened/5.0V:Closed  [SJ_2_SMALL_12_TIED]  28.7,103.89 180 bottom
CAN_T  Opened  [SJ]  27.18,109.6 180 bottom
D1  1N5822/SS34/SMA  [MLL-41]  16.38,20.45 90 top
D2  1N5822/SS34/SMA  [MLL-41]  24.64,35.05 180 top
D3  1N5819S4(SOD-123)  [SOD-123]  132.08,64.77 180 top
D4  1N5819S4(SOD-123)  [SOD-123]  132.08,87.63 180 top
D5  1N5822/SS34/SMA  [MLL-41]  50.93,6.48 0 top
D6  1N5819S4(SOD-123)  [SOD-123]  142.24,107.31 270 top
D7  1N5822/SS34/SMA  [MLL-41]  28.57,4.83 270 top
D8  NA(1N5822/SS34/SMA)  [MLL-41]  22.86,101.09 90 top
D9  1N5822/SS34/SMA  [MLL-41]  22.99,91.44 0 top
D10  SMBJ6.0A/DO214A  [DO214AA]  18.29,107.57 90 top
DBG-UART  HN1x3  [HN1X3]  145.41,105.41 270 top
FET1  IRLML6402(SOT23-3)  [SOT23]  47.75,100.08 270 top
FET2  BSS138(SOT23-3)  [SOT23]  52.58,98.04 0 top
FET3  BSS138(SOT23-3)  [SOT23]  63.75,98.04 0 top
FET4  BSS138(SOT23-3)  [SOT23]  58.17,98.04 0 top
FET5  BSS138(SOT23-3)  [SOT23]  129.79,99.06 0 top
FET6  BSS138(SOT23-3)  [SOT23]  119.63,99.06 180 top
FET7  BSS138(SOT23-3)  [SOT23]  112.14,4.57 270 top
FET8  BSS138(SOT23-3)  [SOT23]  112.14,10.16 270 top
FET9  IRLML6402(SOT23-3)  [SOT23]  19.56,97.28 270 top
FET10  IRLML6402(SOT23-3)  [SOT23]  23.62,95.76 90 top
FET11  BSS138(SOT23-3)  [SOT23]  15.49,94.49 180 top
FID1  FIDUCIAL  [FIDUCIAL-1X3]  1.27,115.57 180 top
FID2  FIDUCIAL  [FIDUCIAL-1X3]  1.27,1.27 180 top
FID3  FIDUCIAL  [FIDUCIAL-1X3]  146.05,115.57 0 top
FID4  FIDUCIAL  [FIDUCIAL-1X3]  1.27,115.57 0 bottom
FID5  FIDUCIAL  [FIDUCIAL-1X3]  1.27,1.27 0 bottom
FID6  FIDUCIAL  [FIDUCIAL-1X3]  146.05,115.57 0 bottom
FUSE1  FSMD035/1206  [1206]  66.29,103.63 90 top
FUSE2  NA(5025)  [R5025]  18.03,102.87 180 top
GND  TESTPADTESTPAD_40-ROUND  [TESTPAD_40-ROUND]  112.39,1.27 0 bottom
GND_  TESTPADTESTPAD_40-ROUND  [TESTPAD_40-ROUND]  17.78,1.27 0 bottom
GND_PIN1  TESTPAD3  [TEST_PAD40/70/SQUARE]  50.8,1.91 90 top
GPIO  GBH254SMT-34  [ML34-MALE(GBH-254-SMT-34)_TEST]  5.71,78.74 90 top
HDMI  HDMI-SWM-19  [HDMI-SWM-19_TEST]  57.78,113.28 0 top
HEADPHONES/LINEOUT  PJ-W47S-05D2-LF_V2  [PJ-W47S-05D2-LF_5PIN_V2]  106.05,0 90 top
IR1  RPM7236-H8  [RPM7236]  128.27,3.81 180 top
IR_LED1  LED/IR333-A/5mm  [LED-5.0MM]  137.79,3.81 0 top
KEY-ADC  NA(HR1x2)  [JP1R]  10.16,5.08 180 top
L1  2.2uH/4.5A/28mR/20%/CD75/7.8x7.0x5.0mm(YS75-2R2M)  [CD73(75)]  22.86,20.45 180 top
L2  10uH/4.0A/36mR/20%/8.3x8.3x5.0mm(YSRH8D43-100M)  [CDRH8D43]  22.86,29.21 180 top
L3  FB0805/600R/2A  [L0805_5MIL_DWS]  55.37,7.62 90 top
L4  FB0805/600R/2A  [L0805_5MIL_DWS]  104.52,20.07 270 top
L5  FB0805/600R/2A  [L0805_5MIL_DWS]  106.55,20.07 270 top
L6  FB0805/600R/2A  [L0805_5MIL_DWS]  108.58,20.07 270 top
L7  FB0805/600R/2A  [L0805_5MIL_DWS]  63.12,7.62 270 top
L8  NA(FB0805/600R/2A)  [L0805_5MIL_DWS]  123.06,33.91 90 top
L9  FB0805/600R/2A  [L0805_5MIL_DWS]  125.09,33.91 270 top
L10  FB0805/600R/2A  [L0805_5MIL_DWS]  36.96,13.46 180 top
L11  FB0805/600R/2A  [L0805_5MIL_DWS]  78.74,19.94 270 top
L12  FB0805/600R/2A  [L0805_5MIL_DWS]  25.02,9.65 0 top
L13  FB0805/600R/2A  [L0805_5MIL_DWS]  48.13,14.22 270 top
L14  FB0805/600R/2A  [L0805_5MIL_DWS]  112.65,20.07 90 top
L15  2.2uH/4.5A/28mR/20%/CD75/7.8x7.0x5.0mm(YS75-2R2M)  [CD73(75)]  22.35,85.6 90 top
L16  FB0805/600R/2A  [L0805_5MIL_DWS]  40.51,14.22 270 top
L17  FB0805/600R/2A  [L0805_5MIL_DWS]  49.02,8.76 180 top
L18  3.3nH/120R/400mA/L0603  [L0603_5MIL_DWS]  139.32,14.48 90 top
LAN_GIGA(1000)_1  NA(TM211Q01FM22)  [TM211Q01FM22_SH]  78.11,107.95 0 top
LAN_GIGA(1000)_2  TM211Q01FM22  [TM211Q01FM22_SH]  99.06,107.95 0 top
LAN_MEGA(100)_1  RJLBC-060TC1  [RJLBC-060TC1_MILLING]  78.11,108.33 180 top
LAN_MEGA(100)_2  NA(RJLBC-060TC1)  [RJLBC-060TC1_MILLING]  99.06,108.33 180 top
LED1  LED/Green/0603  [LED-0603_TEST]  133.35,57.15 180 top
LED1_E  Closed  [SJ-CLOSE]  129.54,58.93 0 top
LED2  LED/Yellow/0603  [LED-0603_TEST]  133.35,49.53 180 top
LED2_E  Closed  [SJ-CLOSE]  129.54,51.31 0 top
LIPO_BAT  DW02S  [DW02S]  3.17,108.58 0 top
MIC/LINEIN  PJ-W47S-05D2-LF_V2  [PJ-W47S-05D2-LF_5PIN_V2]  95.25,0 90 top
MICRO_SD  TFC-WPAPR-08  [TFC-WPAPR-08_BIGGER_CREAM]  78.11,8.64 270 top
PCIE-X4  PCIX-VPC-064-LF  [PCIX-VPC-064-LF]  5.84,29.84 270 top
PCIE_5.0VEXT/5.0VIN  PCIE_5.0VEXT:Closed/5.0VIN:Opened  [SJ_2_SMALL_12_TIED]  16.76,45.72 0 bottom
PWR_BUT  T1107A(6X3,8X2,5MM)  [WS-TAKT_6X3.5_SMD_NOCREAM]  142,38.5 90 top
PWR_JACK  PWRJ-2mm(YDJ-1134)  [PWR_JACK_UNI_MILLING_SMALLER_DRILLS]  6.73,105.92 270 top
PWR_LED  LED/Red/0603  [LED-0603_TEST]  133.35,41.91 180 top
R1  10k/R0603  [R0603_5MIL_DWS]  25.15,104.78 90 top
R2  NA/R0603  [R0603_5MIL_DWS]  25.15,101.47 270 top
R3  NA(510R/R0402)  [R0402_SMALL]  53.59,101.6 270 top
R4  2.2k/R0603  [R0603_5MIL_DWS]  133.35,58.93 0 top
R5  2.2k/R0603  [R0603_5MIL_DWS]  133.35,51.31 0 top
R6  100k/R0603  [R0603_5MIL_DWS]  47.75,95.25 180 top
R7  NA(510R/R0402)  [R0402_SMALL]  55.12,101.6 90 top
R8  10k/R0603  [R0603_5MIL_DWS]  43.69,95.25 180 top
R9  NA(510R/R0402)  [R0402_SMALL]  56.9,101.6 270 top
R10  27k/R0603  [R0603_5MIL_DWS]  55.37,98.04 270 top
R11  1.05k/1%/R0603  [R0603_5MIL_DWS]  32.38,98.55 0 top
R12  120R/R1206  [R1206_5MIL_WS]  25.65,109.47 180 top
R13  2.2k/R0603  [R0603_5MIL_DWS]  33.27,100.97 90 top
R14  NA/R0603  [R0603_5MIL_DWS]  32.38,104.78 270 top
R15  NA(510R/R0402)  [R0402_SMALL]  57.91,101.6 270 top
R16  2.2k/R0603  [R0603_5MIL_DWS]  60.07,101.73 270 top
R17  2.2k/R0603  [R0603_5MIL_DWS]  61.59,101.73 270 top
R18  10k/R0603  [R0603_5MIL_DWS]  63.63,105.16 180 top
R19  2.2k/R0603  [R0603_5MIL_DWS]  66.55,97.92 90 top
R20  2.2k/R0603  [R0603_5MIL_DWS]  60.96,98.04 90 top
R21  20k/1%/R0603  [R0603_5MIL_DWS]  63.37,101.73 270 top
R22  100R/R0603  [R0603_5MIL_DWS]  134.62,38.1 180 top
R23  100R/R0603  [R0603_5MIL_DWS]  133.35,45.72 180 top
R24  100R/R0603  [R0603_5MIL_DWS]  134.62,36.58 180 top
R25  100R/R0603  [R0603_5MIL_DWS]  133.35,53.47 180 top
R26  NA/R0603  [R0603_5MIL_DWS]  56.39,94.36 90 top
R27  NA/R0603  [R0603_5MIL_DWS]  57.91,94.36 270 top
R28  NA/R0603  [R0603_5MIL_DWS]  54.86,94.36 90 top
R29  NA(100R/R0603)  [R0603_5MIL_DWS]  13.59,98.93 90 top
R30  NA(100R/R0603)  [R0603_5MIL_DWS]  16.64,98.93 90 top
R31  NA/R0603  [R0603_5MIL_DWS]  59.44,94.36 90 top
R32  100R/R0603  [R0603_5MIL_DWS]  12.06,98.93 90 top
R33  100R/R0603  [R0603_5MIL_DWS]  15.11,98.93 90 top
R34  NA/R0603  [R0603_5MIL_DWS]  71.63,94.36 90 top
R35  100R/R0603  [R0603_5MIL_DWS]  67.06,94.36 90 top
R36  100R/R0603  [R0603_5MIL_DWS]  70.1,94.36 90 top
R37  NA/R0603  [R0603_5MIL_DWS]  68.58,94.36 90 top
R38  100R/R0603  [R0603_5MIL_DWS]  82.3,94.36 90 top
R39  NA/R0603  [R0603_5MIL_DWS]  80.77,94.36 90 top
R40  NA/R0603  [R0603_5MIL_DWS]  73.15,94.36 90 top
R41  NA/R0603  [R0603_5MIL_DWS]  11.81,32 270 top
R42  0R/R0603(Board_Mounted)  [0603_0R]  11.56,46.35 90 top
R43  NA/R0603  [R0603_5MIL_DWS]  12.7,15.24 0 top
R44  100R/R0603  [R0603_5MIL_DWS]  79.25,94.36 90 top
R45  NA/R0603  [R0603_5MIL_DWS]  12.7,16.76 0 top
R46  NA/R0603  [R0603_5MIL_DWS]  83.82,94.36 90 top
R47  NA/R0603  [R0603_5MIL_DWS]  26.54,13.34 180 top
R48  20k/1%/R0603  [R0603_5MIL_DWS]  17.78,13.46 180 top
R49  NA/R0603  [R0603_5MIL_DWS]  62.48,94.36 90 top
R50  NA/R0603  [R0603_5MIL_DWS]  64.01,94.36 90 top
R51  NA/R0603  [R0603_5MIL_DWS]  60.96,94.36 90 top
R52  0R/R0603(Board_Mounted)  [0603_0R]  11.81,20.7 270 top
R53  NA/R0603  [R0603_5MIL_DWS]  65.53,94.36 90 top
R54  10k/R0603  [R0603_5MIL_DWS]  12.7,23.11 0 top
R55  100k/R0603  [R0603_5MIL_DWS]  26.54,11.81 180 top
R56  1.05k/1%/R0603  [R0603_5MIL_DWS]  17.78,11.94 180 top
R57  3.32k/1%/R0603  [R0603_5MIL_DWS]  20.45,43.18 180 top
R58  100R/R0603  [R0603_5MIL_DWS]  109.35,94.87 90 top
R59  NA/R0603  [R0603_5MIL_DWS]  113.92,94.87 270 top
R60  NA/R0603  [R0603_5MIL_DWS]  110.87,94.87 90 top
R61  100k/R0603  [R0603_5MIL_DWS]  18.03,41.27 90 top
R62  68k/R0603  [R0603_5MIL_DWS]  27.05,43.18 180 top
R63  1.05k/1%/R0603  [R0603_5MIL_DWS]  23.75,43.18 0 top
R64  100R/R0603  [R0603_5MIL_DWS]  112.39,94.87 90 top
R65  NA/R0603  [R0603_5MIL_DWS]  95.63,94.87 90 top
R66  NA/R0603  [R0603_5MIL_DWS]  91.06,94.87 90 top
R67  100R/R0603  [R0603_5MIL_DWS]  28.19,38.35 180 top
R68  100R/R0603  [R0603_5MIL_DWS]  11.56,49.78 270 top
R69  NA/R0603  [R0603_5MIL_DWS]  94.11,94.87 90 top
R70  NA/R0603  [R0603_5MIL_DWS]  92.58,94.87 90 top
R71  NA/R0603  [R0603_5MIL_DWS]  106.3,94.87 90 top
R72  NA/R0603  [R0603_5MIL_DWS]  104.78,94.87 90 top
R73  NA/R0603  [R0603_5MIL_DWS]  97.16,94.87 90 top
R74  NA/R0603  [R0603_5MIL_DWS]  103.25,94.87 90 top
R75  NA/R0603  [R0603_5MIL_DWS]  107.82,94.87 90 top
R76  100R/R0603  [R0603_5MIL_DWS]  118.49,94.87 90 top
R77  NA/R0603  [R0603_5MIL_DWS]  116.97,94.87 90 top
R78  NA/R0603  [R0603_5MIL_DWS]  120.02,94.87 90 top
R79  NA(2.2k/R0603)  [R0603_5MIL_DWS]  133.35,68.83 180 top
R80  10k/R0603  [R0603_5MIL_DWS]  130.18,67.94 90 top
R81  NA(2.2k/R0603)  [R0603_5MIL_DWS]  133.35,67.31 180 top
R82  10k/R0603  [R0603_5MIL_DWS]  133.35,72.39 180 top
R83  NA(2.2k/R0603)  [R0603_5MIL_DWS]  133.35,91.69 180 top
R84  10k/R0603  [R0603_5MIL_DWS]  130.18,90.81 90 top
R85  NA(2.2k/R0603)  [R0603_5MIL_DWS]  133.35,90.17 180 top
R86  10k/R0603  [R0603_5MIL_DWS]  133.35,95.25 180 top
R87  100R/R0603  [R0603_5MIL_DWS]  115.44,94.87 90 top
R88  390R/R0603  [R0603_5MIL_DWS]  123.95,99.06 90 top
R89  390R/R0603  [R0603_5MIL_DWS]  125.48,99.06 90 top
R90  10k/R0603  [R0603_5MIL_DWS]  142.24,102.74 270 top
R91  NA/R0603  [R0603_5MIL_DWS]  127,99.06 90 top
R92  NA/R0603  [R0603_5MIL_DWS]  122.43,99.06 90 top
R93  10k/R0603  [R0603_5MIL_DWS]  60.58,7.62 90 top
R94  10k/R0603  [R0603_5MIL_DWS]  61.72,14.1 270 top
R95  100k/R0603  [R0603_5MIL_DWS]  96.39,19.81 270 top
R96  100R/R0603  [R0603_5MIL_DWS]  132.59,99.06 270 top
R97  100R/R0603  [R0603_5MIL_DWS]  116.84,99.06 90 top
R98  2.2k/R0603  [R0603_5MIL_DWS]  94.87,19.81 270 top
R99  0R/R0603(Board_Mounted)  [0603_0R]  88.65,19.81 90 top
R100  6.8R/R1206  [R1206_5MIL]  123.83,10.67 90 top
R101  20k/1%/R0603  [R0603_5MIL_DWS]  61.72,17.4 270 top
R102  6.81k/1%/R0603  [R0603_5MIL_DWS]  59.82,14.1 90 top
R103  100k/R0603  [R0603_5MIL_DWS]  60.83,19.81 180 top
R104  100k/R0603  [R0603_5MIL_DWS]  97.92,19.81 270 top
R105  2.2k/R0603  [R0603_5MIL_DWS]  99.44,19.81 270 top
R106  2.2k/R0603  [R0603_5MIL_DWS]  135.25,12.95 270 top
R107  100R/R0603  [R0603_5MIL_DWS]  138.43,22.23 180 top
R108  10k/R0603  [R0603_5MIL_DWS]  113.92,15.88 90 top
R109  10k/R0603  [R0603_5MIL_DWS]  112.39,15.88 90 top
R110  NA(100R/R0603)  [R0603_5MIL_DWS]  138.43,20.7 180 top
R111  10k/R0603  [R0603_5MIL_DWS]  133.22,12.95 90 top
R112  100R/R0603  [R0603_5MIL_DWS]  138.05,33.91 270 top
R113  NA(100R/R0603)  [R0603_5MIL_DWS]  136.53,33.91 270 top
R114  10k/R0603  [R0603_5MIL_DWS]  23.24,11.81 0 top
R115  10k/R0603  [R0603_5MIL_DWS]  31.62,16.26 270 top
R116  100k/R0603  [R0603_5MIL_DWS]  82.04,19.94 90 top
R117  100R/R0603  [R0603_5MIL_DWS]  130.81,12.95 90 top
R118  10k/R0603  [R0603_5MIL_DWS]  80.52,19.94 90 top
R119  2.2k/R0603  [R0603_5MIL_DWS]  112.14,1.78 180 top
R120  2.2k/R0603  [R0603_5MIL_DWS]  112.14,7.37 180 top
R121  20k/1%/R0603  [R0603_5MIL_DWS]  31.62,19.56 270 top
R122  13k/1%/R0603  [R0603_5MIL_DWS]  38.73,16.26 90 top
R123  100k/R0603  [R0603_5MIL_DWS]  38.73,19.56 270 top
R124  2.2k/R0603  [R0603_5MIL_DWS]  70.48,19.94 90 top
R125  6.81k/1%/R0603  [R0603_5MIL_DWS]  53.98,14.61 90 top
R126  100k/R0603  [R0603_5MIL_DWS]  53.72,18.29 90 top
R128  2.2k/R0603  [R0603_5MIL_DWS]  133.35,43.81 0 top
R129  10k/R0603  [R0603_5MIL_DWS]  19.56,94.49 180 top
R130  100k/R0603  [R0603_5MIL_DWS]  118.11,22.23 270 top
R131  49.9k/1%/R0603  [R0603_5MIL_DWS]  13.84,90.56 90 top
R132  10k/R0603  [R0603_5MIL_DWS]  20.83,108.33 270 top
R133  10k/R0603  [R0603_5MIL_DWS]  26.42,95.76 270 top
R134  13k/1%/R0603  [R0603_5MIL_DWS]  46.35,14.61 90 top
R135  100k/R0603  [R0603_5MIL_DWS]  46.35,18.29 90 top
R136  100k/R0603  [R0603_5MIL_DWS]  25.65,98.55 180 top
R137  6.81k/1%/R0603  [R0603_5MIL_DWS]  13.84,87 270 top
R138  100k/R0603  [R0603_5MIL_DWS]  13.84,83.44 270 top
RECOVERY  T1107A(6X3,8X2,5MM)  [WS-TAKT_6X3.5_SMD_NOCREAM]  142,30.5 90 top
RESET  T1107A(6X3,8X2,5MM)  [WS-TAKT_6X3.5_SMD_NOCREAM]  142,53.5 90 top
RM1  RA1206_(4x0603)_4B8_100k  [R_MATRIX_4]  133.73,33.91 0 top
RM2  RA1206_(4x0603)_4B8_100k  [R_MATRIX_4]  129.67,33.91 0 top
RM3  RA1206_(4X0603)_4B8_22R  [R_MATRIX_4]  117.73,2.79 180 top
RM4  RA1206_(4X0603)_4B8_22R  [R_MATRIX_4]  116.71,15.88 0 top
RM5  RA1206_(4X0603)_4B8_22R  [R_MATRIX_4]  120.78,15.88 0 top
RM6  RA1206_(4x0603)_4B8_100k  [R_MATRIX_4]  73.28,19.94 0 top
SATA  SATA-PWA-07  [SATA-PWA-07-TEST]  37.47,113.67 0 top
SOM204-EVB_PLATFORM  DDR204(2-2013289-1)  [DDR204(2-2013289-1)]  37.5,58.42 270 top
T1  DTC114YKA(SOT23-3)  [SOT-23]  39.62,98.04 90 top
T2  BC817-40(SOT23-3)  [SOT23]  134.24,9.14 90 top
U1  NA(RCLAMP0524P)  [SLP2510P8]  54.48,105.16 0 top
U2  MCP2551-I/SN(SO8)  [SO-08]  28.7,103.25 0 top
U3  NA(RCLAMP0524P)  [SLP2510P8]  57.53,105.16 0 top
U4  NA(RCLAMP0524P)  [SLP2510P8]  60.58,105.16 0 top
U5  MT3608(SOT23-6)  [SOT23-6]  22.35,14.86 180 top
U6  MP1584EN(SOIC8E)  [SOIC8E]  22.48,39.24 90 top
U7  SY6280(SOT23-5)  [SOT23-5]  57.15,18.29 270 top
U8  SY6280(SOT23-5)  [SOT23-5]  35.94,17.02 270 top
U9  RTL8723BS(RL-SM02BD/COMBO_MODULE)  [RL-SM02BD(RTL8723BS)]  129.67,22.1 180 top
U10  SY6280(SOT23-5)  [SOT23-5]  51.18,18.29 270 top
U11  NA(BD5245G-TR(SSOP5/SOT-23-5))  [SOT23-5]  28.96,90.93 90 top
U12  SY6280(SOT23-5)  [SOT23-5]  43.56,18.29 270 top
U13  MT3608(SOT23-6)  [SOT23-6]  16.38,87.88 90 top
U14  MCP120T-475I/TT(SOT23-3)  [SOT23]  29.34,95.76 180 top
U$2  [ATTENTION]  11.56,107.31 0 bottom
U$5  [LOGO-OPENHARDWARE_8X8]  68.83,42.93 0 bottom
U$6  [OLIMEX1_V]  57.15,61.59 0 bottom
U$8  [OLIMEX1_V]  122.56,71.12 90 top
U$9  [PB]  77.98,40.51 0 bottom
U$10  [ESD_SYMBOL]  108.58,37.85 0 bottom
U$11  [RECYCLE_BIN1/8]  60.96,37.85 0 bottom
U$12  [ROHS]  98.93,38.48 0 bottom
UBOOT  T1107A(6X3,8X2,5MM)  [WS-TAKT_6X3.5_SMD_NOCREAM]  142,46 90 top
UEXT-1  GBH254SMT-10  [ML10-MALE(GBH-254-SMT-10)_TEST]  141.6,67.31 90 top
UEXT-2  GBH254SMT-10  [ML10-MALE(GBH-254-SMT-10)_TEST]  141.6,90.17 90 top
USB2.0_HOST  USBB1-FRWH-4A(USB-Ax2)  [USB_TWO_LEVEL]  38.73,5.33 0 top
USB2.0_OTG  USB-OTG(MSB-SW-5AB-LF)  [USB_MINI_9PIN]  20.7,3.3 270 top
USB_MICRO_3.0-AB  KMMX-AB10-SMT1SB30TR  [USB_MICRO_3.0]  61.59,2.03 0 top
VGA_DB15-F  VGA15(DB15-F)  [DB15-F_22MM]  125.09,111.51 180 top
VR1  AP1231-1.8V(SOT23-5)  [SOT-23-5]  120.52,22.23 90 top
VR2  AP1231-2.8V(SOT23-5)  [SOT-23-5]  115.7,22.23 90 top
VR3  NA(AP1231-1.8V(SOT23-5))  [SOT-23-5]  128.27,38.23 0 top
WIFI(BT)_GPIO1  WiFi(BT)_GPIO6  [TESTPAD_40-ROUND]  109.86,1.27 180 bottom

## Tracks (layer width: path | path; a pad name or v marks a point on that pad's centre or on a via)
+3.0V_RTC_BACKUP-BAT  (via drill 0.6)
  Top 0.254: SOM204-EVB_PLATFORM.23 30.38,83.47 29.72,82.8 29.72,81.53 29.21,81.03 27.18,81.03 v26.42,80.26 | GPIO.6 2.54,63.5
  Top 1.016: v23.62,60.45 18.8,60.45 17.78,61.47 14.73,61.47 13.97,62.23 5.46,62.23 4.19,63.5 GPIO.6 | 3.0V-BAT_RTC.1+ 23.62,48.5 v23.62,50.8 v22.61,50.8 | v22.61,50.8 22.61,48.51 | v22.61,50.8 v21.72,50.8 21.72,49.53
  Bottom 1.016: v26.42,80.26 26.42,65.99 23.62,63.2 v23.62,60.45 23.62,52.7 | 23.62,52.7 23.62,51.82 | 23.62,51.82 v23.62,50.8 v22.61,50.8 | v22.61,50.8 v21.72,50.8 23.62,52.7 | 23.62,51.82 v22.61,50.8
+3.3VAUX
  Top 0.508: R52.1 11.43,21.59 10.68,22.34 PCIE-X4.20
  Top 1.016: R52.1 C22.1
+3.7V_BAT_STEP-UP_DCDC_EN
  Top 0.254: SOM204-EVB_PLATFORM.21 32.51,84.07 27.56,84.07 25.65,85.98 18.41,85.98 18.03,86.36 18.03,87.38 17.78,87.63 15.88,87.63 | R138.2 14.86,83.57 14.86,85.72 15.43,86.3 U13.4 15.37,86.58 15.37,87.38 15.56,87.57 | 15.56,87.57 15.62,87.63 15.88,87.63 | 15.56,87.31 15.56,86.71 | 15.56,87.57 15.56,87.31 | 15.56,87.31 15.88,87.63
+5.0V_USB_PWR  (via drill 0.6)
  Top 0.254: 29.46,80.52 30.23,81.28 30.23,82.55 30.55,82.87 SOM204-EVB_PLATFORM.25 34.29,82.87 34.29,82.68 | 28.57,80.52 27.69,80.52 v27.69,80.14 | 29.46,80.52 28.57,80.52 | 28.57,80.52 v28.57,80.14 | v29.46,80.14 29.46,80.52 | 30.96,78.11 30.96,77.85 31.24,77.85 31.75,78.36 | 31.75,78.36 31.88,78.49 | 31.88,78.49 31.88,82.04 32.1,82.27 SOM204-EVB_PLATFORM.27 34.29,82.27 34.29,82.42 | 31.88,78.49 30.84,78.49 | 31.75,78.36 30.71,78.36 | 34.29,82.55 34.29,82.42 | 34.29,82.68 34.29,82.55 | 34.29,82.68 31.37,82.68 | 34.29,82.55 31.37,82.55 | 34.29,82.42 32,82.42 31.75,82.17
  Top 1.016: 27.69,7.27 D7.K | 27.69,7.27 v27.69,8.64 v29.46,8.64 v29.46,5.97 | v28.57,5.97 D7.K | D7.K v28.57,8.64 | v28.57,5.97 v29.46,5.97 | 27.69,7.27 v27.69,5.97 v28.57,5.97 | v28.57,5.97 v29.46,5.97 | v29.46,78.11 30.96,78.11 | v28.57,78.11 v27.69,78.11 v27.69,79.12 v27.69,80.14 | v29.46,78.11 v28.57,78.11 | v29.46,79.12 v29.46,78.11 | v29.46,80.14 v29.46,79.12 | v28.57,80.14 v28.57,79.12 v28.57,78.11 | v29.46,79.12 31.5,79.12 | v29.46,80.14 31.37,80.14 | 31.37,80.14 31.37,78.61 | 31.37,80.14 31.37,82.42 30.73,82.42 30.61,82.3 30.61,80.9 29.84,80.14 v29.46,80.14 | v29.46,5.97 30.48,5.97 30.61,5.84 | 30.61,5.84 30.99,5.46 32.89,5.46 35.43,2.92 42.04,2.92 44.32,5.21 | 44.32,5.21 46.35,5.21 | 46.35,5.21 v47.37,5.21 | v48.51,5.21 v47.37,5.21 | v48.51,5.21 48.51,6.48 D5.K 48.48,6.99 | 30.61,5.84 29.08,7.37 | v49.66,5.21 49.28,5.21 49.28,6.99 48.48,6.99 | v49.66,5.21 v48.51,5.21 | v47.37,5.21 v47.37,6.22 | v47.37,6.22 48.51,6.22 | 46.35,5.21 v47.37,6.22 | 44.32,5.21 44.96,5.84 47.24,5.84 | v47.37,6.22 48.13,6.99 48.48,6.99 | 48.48,6.99 48.51,6.99 | v49.66,5.21 v49.66,6.1 v49.66,6.99
  Bottom 1.016: v29.46,5.97 v27.69,5.97 27.69,6.86 | v29.46,5.97 29.46,6.86 | 44.32,5.21 42.04,2.92 35.43,2.92 32.89,5.46 30.99,5.46 30.48,5.97 | 30.48,5.97 29.46,6.99 v29.46,8.64 | v29.46,5.97 30.48,5.97 | 44.32,5.21 44.96,5.84 46.86,5.84 47.12,6.1 | 47.12,6.1 48.01,6.99 v49.66,6.99 v49.66,5.21 44.32,5.21 | v49.66,6.1 47.12,6.1 | v29.46,80.14 v27.69,80.14 27.69,79.25 28.57,79.25 29.46,79.25 v29.46,80.14
  Bottom 2.794: 28.57,79.25 28.57,65.02 27.05,63.5 27.05,51.56 33.4,45.21 33.4,29.46 31.24,27.3 31.24,13.08 28.57,10.41 v28.57,8.64 28.57,6.86
+5V  (via drill 0.4, 0.6)
  Top 0.508: U12.5 42.67,19.65 42.67,21.34 C68.2 | U12.5 40.23,21.97 v39.24,21.97 | U12.5 42.61,20.25 41.27,21.59 v41.27,21.97 | VR1.1 121.47,23.62 v122.3,23.62 122.05,23.88 121.54,23.88 | VR2.1 116.65,25.53 C62.2 117.22,25.53 v117.22,26.67 | 121.54,24.64 121.03,25.15 v121.03,26.67
  Top 0.762: C60.2 121.54,24.64 121.54,23.88 121.54,23.24 122.3,23.24 v122.3,23.62 122.3,25.15 121.79,25.65 | v121.03,26.67 v121.79,26.67 | 121.79,25.65 121.79,25.4 | v121.03,27.3 v121.03,26.67 | v121.03,27.3 v121.79,27.3 v121.79,26.67 | v121.79,26.67 121.79,25.65 | v116.46,26.67 116.46,26.04 | v116.46,26.67 v117.22,26.67 | v116.46,26.67 v116.46,27.3 v117.22,27.3 | v117.22,27.3 v117.22,26.67 | C62.2 116.46,25.53 v116.46,26.67 | v117.22,27.3 v121.03,27.3 | v117.22,26.67 117.22,26.92 121.03,26.92 v121.03,26.67 | C40.2 56.2,21.34 U7.5 55.5,20.29 55.5,21.72 56.01,21.72 56.13,21.72 | v60.83,100.84 v60.83,100.2 | v60.83,100.2 60.2,100.84 | v60.83,100.2 61.47,100.84 | FUSE1.1 65.66,102.23 v65.66,100.97 v66.42,100.97 | v66.42,100.97 66.42,102.23 67.18,102.23 v67.18,100.97 v66.42,100.97
  Top 1.016: 22.67,96.9 20.83,96.9 20.57,96.65 20.45,96.52 20.45,96.18 FET9.2 20.45,96.12 R129.1 v20.45,93.73 v21.46,93.73 21.46,96.01 | 48.77,98.98 FET1.2 | U8.5 34.99,20.19 C49.2 | 50.23,19.83 U10.5 | 50.23,20.95 50.23,19.83 | C57.2 50.23,21.27 50.23,20.95 | 50.1,20.95 50.23,20.95 | 50.23,19.83 50.23,18.92 v48.9,18.92 48.9,19.05 | 124.46,98.17 R89.1 | 124.46,98.17 R88.1 | v124.46,97.41 124.46,98.17 | R16.2 60.2,100.84 v60.83,100.84 61.47,100.84 R17.2
  Top 1.27: 21.97,98.3 22.32,98.65 D8.K | 23.11,98.04 23.11,96.9 22.67,96.9 FET10.2 22.31,96.86 21.46,96.01 | 23.11,98.04 23.11,98.3 21.97,98.3 | 21.46,96.01 21.45,96.01 | 21.45,96.01 20.57,96.01 | 21.45,96.01 20.57,95.14 | 21.72,98.04 v21.46,97.79 20.57,96.9 20.57,96.65 20.57,96.39 | 21.72,98.04 21.97,98.3 | 21.46,96.01 v21.46,96.77 | 21.46,96.01 21.34,95.89 | R6.1 48.77,95.25 C6.2 48.77,98.17 | 48.77,98.17 48.77,98.98 | 48.77,98.17 48.77,99.31 49.53,100.08 v49.53,100.58 v49.53,101.85 | 21.72,98.04 23.11,98.04 | 34.99,20.19 34.99,21.4 35.56,21.97 v38.23,21.97 v39.24,21.97 v40.26,21.97 v41.27,21.97 42.04,21.97 42.42,21.59 C68.2 | C57.2 50.16,21.97 v48.9,21.97 v48.9,20.95 | v48.9,20.95 50.1,20.95 | v48.9,20.95 v48.9,19.94 | v48.9,19.94 50.04,19.94 | v48.9,19.94 48.9,19.05 | 56.01,21.72 56.13,21.84 v56.13,22.73 v55.12,22.73 55.12,21.03 55.88,20.27
  Top 1.524: v15.88,58.42 v14.86,58.42 v13.84,58.42 v12.83,58.42 GPIO.1
  Route2 0.762: 121.67,26.92 121.67,26.8 v121.79,26.67
  Route2 1.016: v17.91,19.68 v17.91,20.57 | v17.91,20.57 v16,20.57 16,19.68 | v16.89,19.68 16,19.68 | v17.91,20.57 18.11,20.57 18.97,19.71 | 16,19.68 20.7,14.99 21.84,14.99 | v56.13,22.73 56.13,18.92 55.24,18.92 | v117.22,27.3 v117.22,26.67 v116.46,26.67 115.7,26.67 115.7,27.05 | 122.3,26.04 122.3,26.16 v121.79,26.67 | 122.3,26.04 v122.3,23.62 119.89,23.62 118.87,22.61 117.14,22.61 | v121.79,27.3 121.92,27.3 122.3,26.92 122.3,26.04 | 115.06,22.61 116.2,22.61 | 116.2,22.23 116.2,22.61 | 116.2,22.61 117.09,22.61 | 117.09,22.61 117.14,22.61 | 117.14,22.61 116.51,21.97 | 117.09,22.61 116.46,23.24 v116.46,27.3
  Route2 1.27: v111.63,97.41 112.9,98.68 123.19,98.68 v124.46,97.41
  Route2 1.778: 55.12,21.72 55.37,21.97 v56.13,22.73 56.64,23.24 | 56.64,23.24 65.91,23.24 69.09,20.07 80.26,20.07 81.66,18.67 104.27,18.67 105.79,20.19 112.39,20.19 | 115.7,27.18 115.82,27.3 v116.46,27.3 v117.22,27.3 117.22,27.56 117.6,27.56 | 115.7,27.18 115.7,27.05 | 56.64,23.24 50.16,23.24 v48.9,21.97 | 120.02,26.92 119.38,27.56 117.6,27.56 | 120.02,26.92 121.67,26.92 | 117.6,27.56 116.08,27.56 115.7,27.18 | 115.7,27.18 115.7,25.65 | 114.17,21.72 112.65,20.19 112.39,20.19 | 114.17,21.72 115.06,22.61 115.7,23.24 115.7,25.65 | 115.7,25.65 117.6,27.56 | 115.7,27.18 114.17,25.65 114.17,21.72 | 120.02,26.92 120.27,26.67 120.27,25.27 | 120.27,25.27 120.27,24.13 121.92,24.13 | 120.27,25.27 121.92,25.27 | 116.2,22.23 114.17,20.19 112.39,20.19
  Route2 2.54: v17.91,19.68 21.84,15.75 24.89,15.75 31.11,21.97 v38.23,21.97 v41.27,21.97 46.61,21.97 | 46.61,21.97 v48.9,21.97 | v48.9,21.97 48.9,19.68 | 46.61,21.97 48.9,19.68 | v48.9,21.97 51.18,21.97 | 48.9,19.68 51.18,21.97 | 51.18,21.97 55.37,21.97 55.37,19.68 48.9,19.68
  Route15 0.762: 60.83,100.97 v60.83,100.84 60.83,100.58 | 60.83,100.97 v65.66,100.97 v66.42,100.97 v67.18,100.97 | v60.83,100.2 60.83,100.58 | v60.83,100.2 61.34,100.71 67.18,100.71 v67.18,100.97 | 60.2,100.97 60.83,100.97 | 60.2,100.97 58.42,99.19 50.93,99.19 v49.53,100.58 | v60.83,100.2 59.18,98.55 50.67,98.55 50.55,98.68 | 60.83,100.58 59.18,98.93 58.17,98.93 | 60.2,100.97 60.71,101.47 67.18,101.47 v67.18,100.97
  Route15 1.016: v21.46,93.73 v20.45,93.73 20.45,93.6 | 20.45,90.81 20.45,93.6 | 20.45,93.6 20.45,98.55 22.23,98.55 22.23,97.92 | 16.51,21.08 16.51,20.95 16.76,20.7 | 16.76,20.7 v16.89,20.57 | v17.91,20.57 v16.89,20.57 | v16,20.57 v16.89,20.57 | 16.76,20.7 16.89,20.7 v16.89,19.68 v17.91,19.68 | v49.53,101.85 v49.53,100.58 49.53,99.69 50.55,98.68
  Route15 1.27: v67.18,100.97 67.56,100.97 71.5,97.03 92.33,97.03 94.23,95.12 109.98,95.12 111.63,96.77 v111.63,97.41
  Route15 2.54: v15.88,58.42 12.7,58.42 11.43,59.69 | 11.43,59.69 10.16,60.96 | 10.16,60.96 8.76,62.36 8.76,79.12 20.45,90.81 21.46,91.82 v21.46,93.73 v21.46,97.79 | v15.88,58.42 16.89,57.4 16.89,52.07 15.75,50.93 | 15.75,50.93 9.78,44.96 9.78,27.81 16.51,21.08 v17.91,19.68 | 11.43,59.69 15.75,55.37 15.75,50.93 | v15.88,58.42 13.34,60.96 10.16,60.96
  Bottom 0.508: PCIE_5.0VEXT/5.0VIN.3 15.88,45.72 15.88,45.47 14.86,45.47 14.86,45.85 | +5V.1 122.43,3.68 122.43,14.22 124.33,16.13 124.33,21.59 v122.3,23.62
  Bottom 0.762: 27.3,103.89 CAN_3.3V/5.0V.1
  Bottom 1.016: PCIE_5.0VEXT/5.0VIN.3 15.37,45.72 15.37,45.97 | 26.04,100.58 26.04,100.53 25.96,100.46 | 26.04,100.58 26.04,102.74 | 25.96,100.46 25.53,100.46 | 25.53,100.46 25.27,100.46 25.27,100.51 25.2,100.58 | 25.2,100.58 23.88,100.58 5VEXT_E.2 | 23.62,98.93 23.62,100.08 | 25.2,100.58 23.04,98.42 | 48.64,101.85 48.51,101.73 5V_SATA_E.2 | 25.96,100.46 20.75,95.25 | v21.46,93.73 v20.45,93.73 20.45,96.65 | v21.46,93.73 v21.46,94.74 | v21.46,94.74 v21.46,95.76 | v21.46,93.73 26.04,98.3 26.04,99.31 | 26.04,99.31 26.04,100.58 | v21.46,94.74 26.04,99.31 | 25.53,100.46 25.53,103.89
  Bottom 1.27: 23.62,99.06 23.62,100.08 5VEXT_E.2 | v21.46,97.79 22.35,97.79 23.62,99.06 | v21.46,97.79 v21.46,96.77 | v21.46,96.77 23.62,98.93 23.62,99.06 | 26.04,103.89 26.04,102.74 27.3,104.01 | 26.04,103.89 27.3,103.89 27.3,104.01 | v21.46,96.77 20.57,95.89 | v49.53,101.85 48.64,101.85 | 48.51,101.73 48.51,101.6 v49.53,100.58 | 27.3,104.01 27.3,106.05 | v21.46,97.79 20.57,96.9 20.57,95.89 | 20.57,95.89 20.57,95.25 20.75,95.25 | 26.04,103.89 26.04,104.78 | 25.4,104.14 24.77,103.5 24.77,101.35 23.75,100.33 | v21.46,97.79 22.1,98.42 22.86,98.42
  Bottom 1.524: 15.37,46.74 15.37,45.97 | 15.37,46.74 15.88,47.24 15.88,52.83 | 15.88,54.1 15.88,52.83 | 15.88,55.37 15.88,54.1 | 15.88,56.39 15.88,55.37 | 15.88,56.39 v15.88,58.42 15.37,58.42 | 15.37,58.42 v13.84,58.42 | v13.84,58.42 v12.83,58.42 | 15.88,55.37 v12.83,58.42 | 15.88,56.39 v13.84,58.42 | 15.37,58.42 15.37,46.74 | 12.83,57.15 12.83,55.88 15.88,52.83 | v12.83,58.42 12.83,57.15 | 15.88,54.1 12.83,57.15
  Bottom 2.54: v49.53,100.58 v49.53,101.85 49.53,105.03 47.37,107.19 28.45,107.19 27.3,106.05 26.04,104.78 25.4,104.14
+5V_PCIE  (via drill 0.6)
  Top 0.254: R47.1 27.43,13.46 25.91,14.99
  Top 0.762: C25.2 25.91,14.99 25.91,14.86 U5.5
  Top 1.016: v16.26,38.99 18.29,38.99 18.67,38.61 18.16,38.1 17.91,38.1 | 17.91,38.1 18.03,38.23 | v16.26,38.1 17.91,38.1 | v16.26,38.99 16.26,38.73 v16.26,38.1 | v23.24,20.57 25.23,20.57 L1.1 | v16.26,38.1 v15.37,38.1 v15.37,38.99 | v16.26,38.99 v15.37,38.99 | v15.37,38.99 15.37,39.75 v15.49,39.88 | 16.51,38.73 v16.51,39.88 | v15.49,39.88 v16.51,39.88 | v16.51,39.88 v16.51,40.89 v15.49,39.88 | v23.24,20.57 v23.24,21.59 | v23.24,21.59 24.77,21.59 | v23.24,22.61 v23.24,23.62 24.51,23.62 | v23.24,21.59 v23.24,22.61 | v23.24,22.61 24.51,22.61 | v23.24,19.56 v23.24,20.57 | v23.24,19.56 24.77,19.56 | v23.24,19.56 23.24,19.18 24.64,19.18 24.64,18.54 24.64,17.91
  Top 1.27: U6.7 18.67,38.61 C29.2 | 16.26,38.73 16.51,38.73 | C25.2 25.91,17.27 24.64,18.54
  Bottom 0.762: 16.76,44.7 PCIE_5.0VEXT/5.0VIN.2
  Bottom 1.016: v23.24,19.56 23.24,20.32 | 16.38,38.99 v16.26,38.99 | v15.37,38.99 v15.37,38.1 | v16.26,38.1 v15.37,38.1 | v15.37,38.1 15.37,37.52 16.38,36.5
  Bottom 1.27: v16.26,38.99 17.02,39.75 | 17.02,39.75 17.02,44.45 16.76,44.7 16.13,44.07 | v16.26,38.99 v16.26,38.1 17.02,38.1 17.02,39.75 | v16.26,38.99 15.49,38.99 v15.49,39.88 15.49,43.43 16.13,44.07 | 16.13,44.07 16.13,38.73
  Bottom 2.54: 16.38,38.99 16.38,37.59 23.24,30.73 23.24,20.32
+5V_USB2.0_OTG_PWR  (via drill 0.6)
  Top 0.508: 19.1,6.6 USB2.0_OTG.VBUS | v18.29,7.62 19.1,7.62 | 19.1,6.6 19.1,7.62 | 19.05,6.6 19.1,6.6 | v18.29,6.6 19.05,6.6 | 19.05,6.6 19.05,5.59 v18.29,5.59 | 19.1,7.62 19.1,8.64 v18.29,8.64
  Top 1.016: v28.57,1.02 D7.A | 27.56,2.38 D7.A | 27.56,2.38 v27.56,1.02 v28.57,1.02 | 27.56,2.38 v27.56,3.68 v28.57,3.68 | 29.59,2.38 D7.A | 29.59,2.38 v29.59,3.68 v28.57,3.68 | 29.59,2.38 v29.59,1.02 v28.57,1.02 | v28.57,1.02 D7.A | v28.57,3.68 D7.A | 37.97,11.43 37.97,11.56 | 34.16,10.03 v34.04,10.03 | 37.58,10.81 37.58,10.79 37.59,10.79 37.85,11.05 C45.1 | v18.29,5.59 v18.29,8.64 18.8,8.64 18.8,5.59 v18.29,5.59
  Top 1.27: 37.97,11.56 L10.1 | 37.97,11.43 37.97,11.2 37.58,10.81 36.8,10.03 v35.81,10.03 v34.92,10.03 34.16,10.03
  Route15 0.762: 21.34,8.64 21.59,8.64 21.59,9.91 | 21.59,11.68 21.59,10.92 | 21.59,10.92 21.59,9.91 | 20.83,11.68 21.59,10.92 | 21.59,10.92 22.35,11.68 | 24.26,10.67 23.24,11.68 | 21.59,9.91 20.45,8.76
  Route15 1.016: v34.92,10.03 34.8,10.03 | 34.21,10.03 v34.04,10.03 | 29.46,3.68 v29.59,3.68 29.59,2.67 | 29.59,2.03 v29.59,1.02 29.59,0.89 28.57,0.89 v28.57,1.02 | 29.46,2.03 29.59,2.03 | 29.59,2.03 29.59,2.67 | 29.46,2.67 29.59,2.67 | 18.29,5.71 v18.29,5.59 | 24.38,11.68 23.24,11.68 22.35,11.68 21.59,11.68 20.83,11.68 18.92,11.68 18.29,11.05 | 18.29,11.05 18.16,10.92 18.16,9.65 | 18.16,8.64 18.16,9.65 | 18.29,11.05 17.65,10.41 17.65,9.14 | 18.16,9.65 18.16,9.27 18.8,8.64